# EAGLE design CPN v2 (EAGLE 9.6.2)
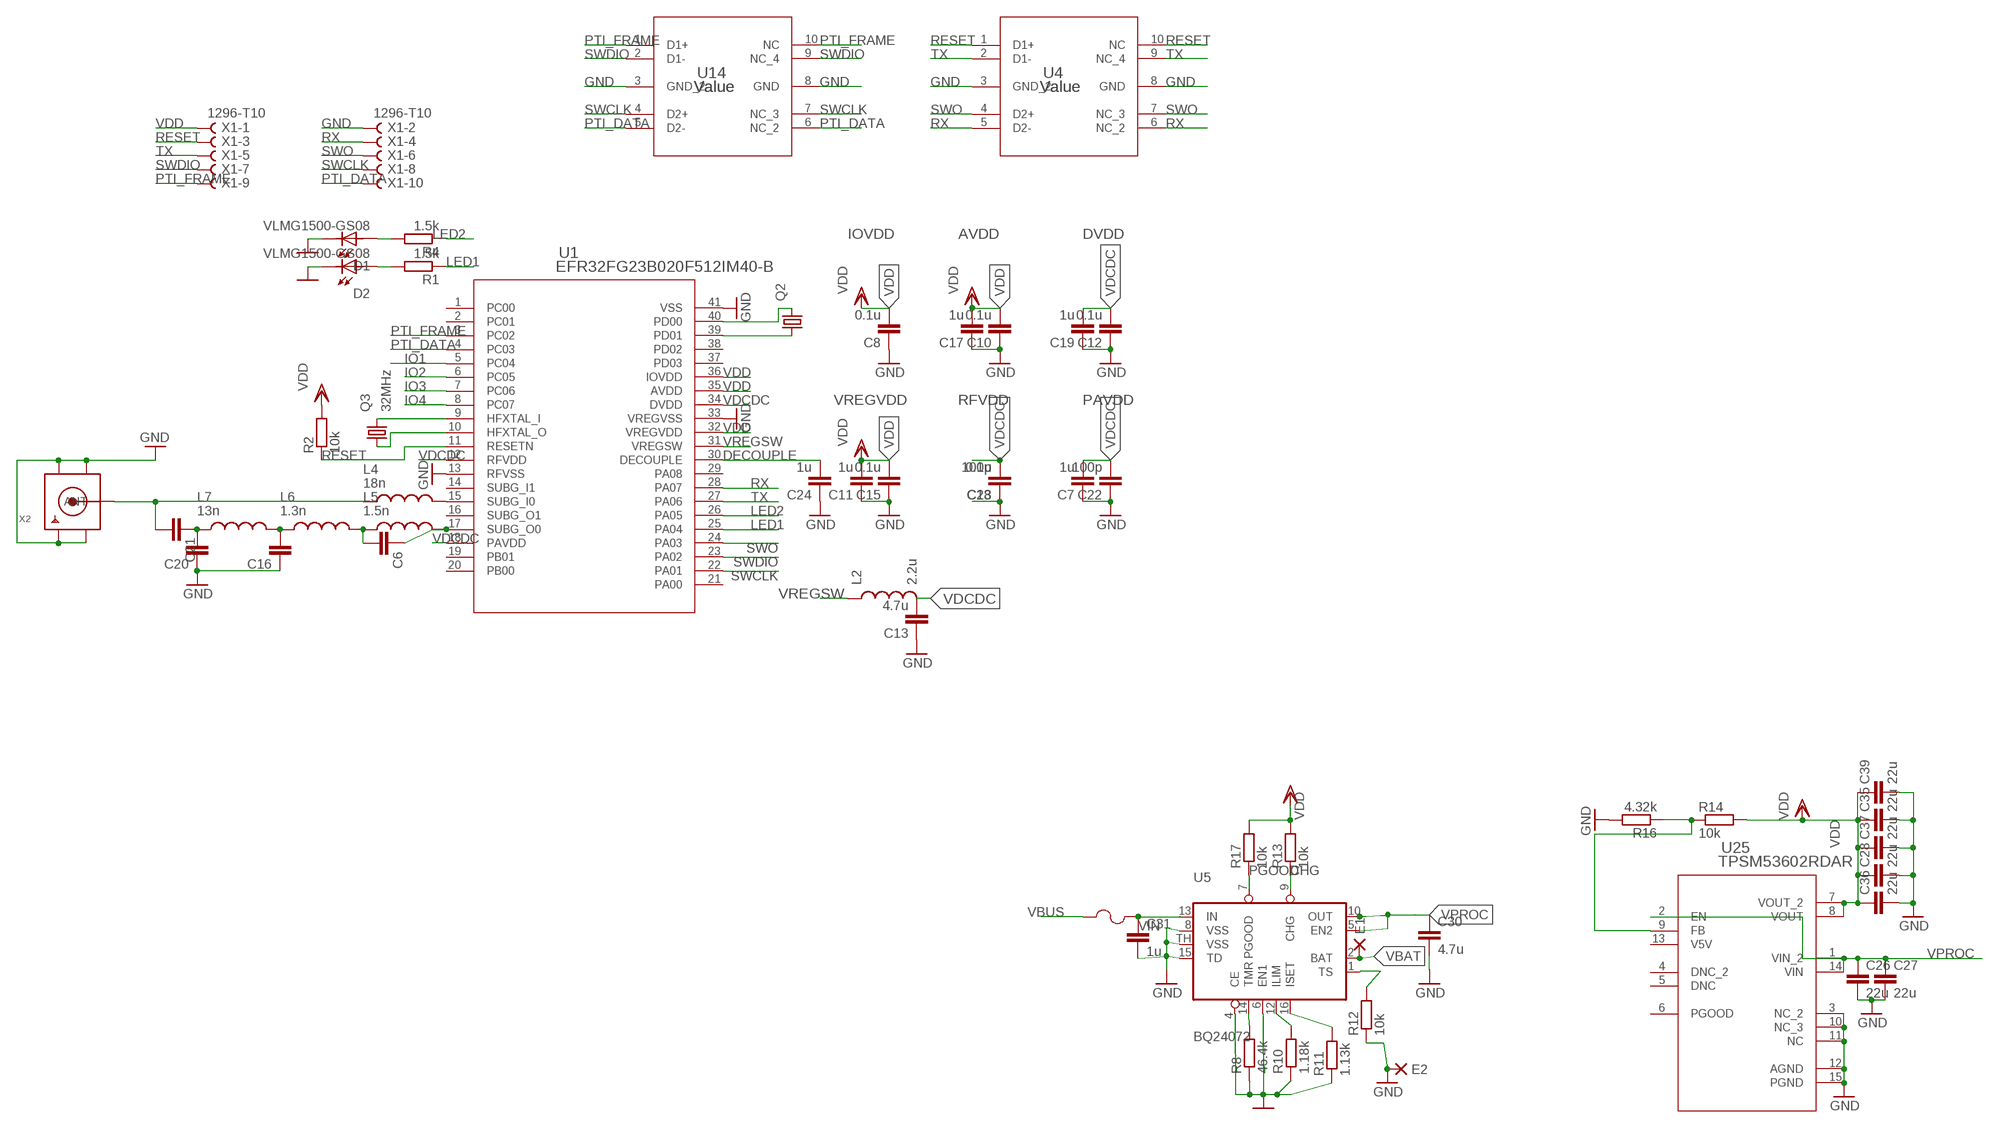
[diagram p0: schematic, sheet 1, part 1 of 2]
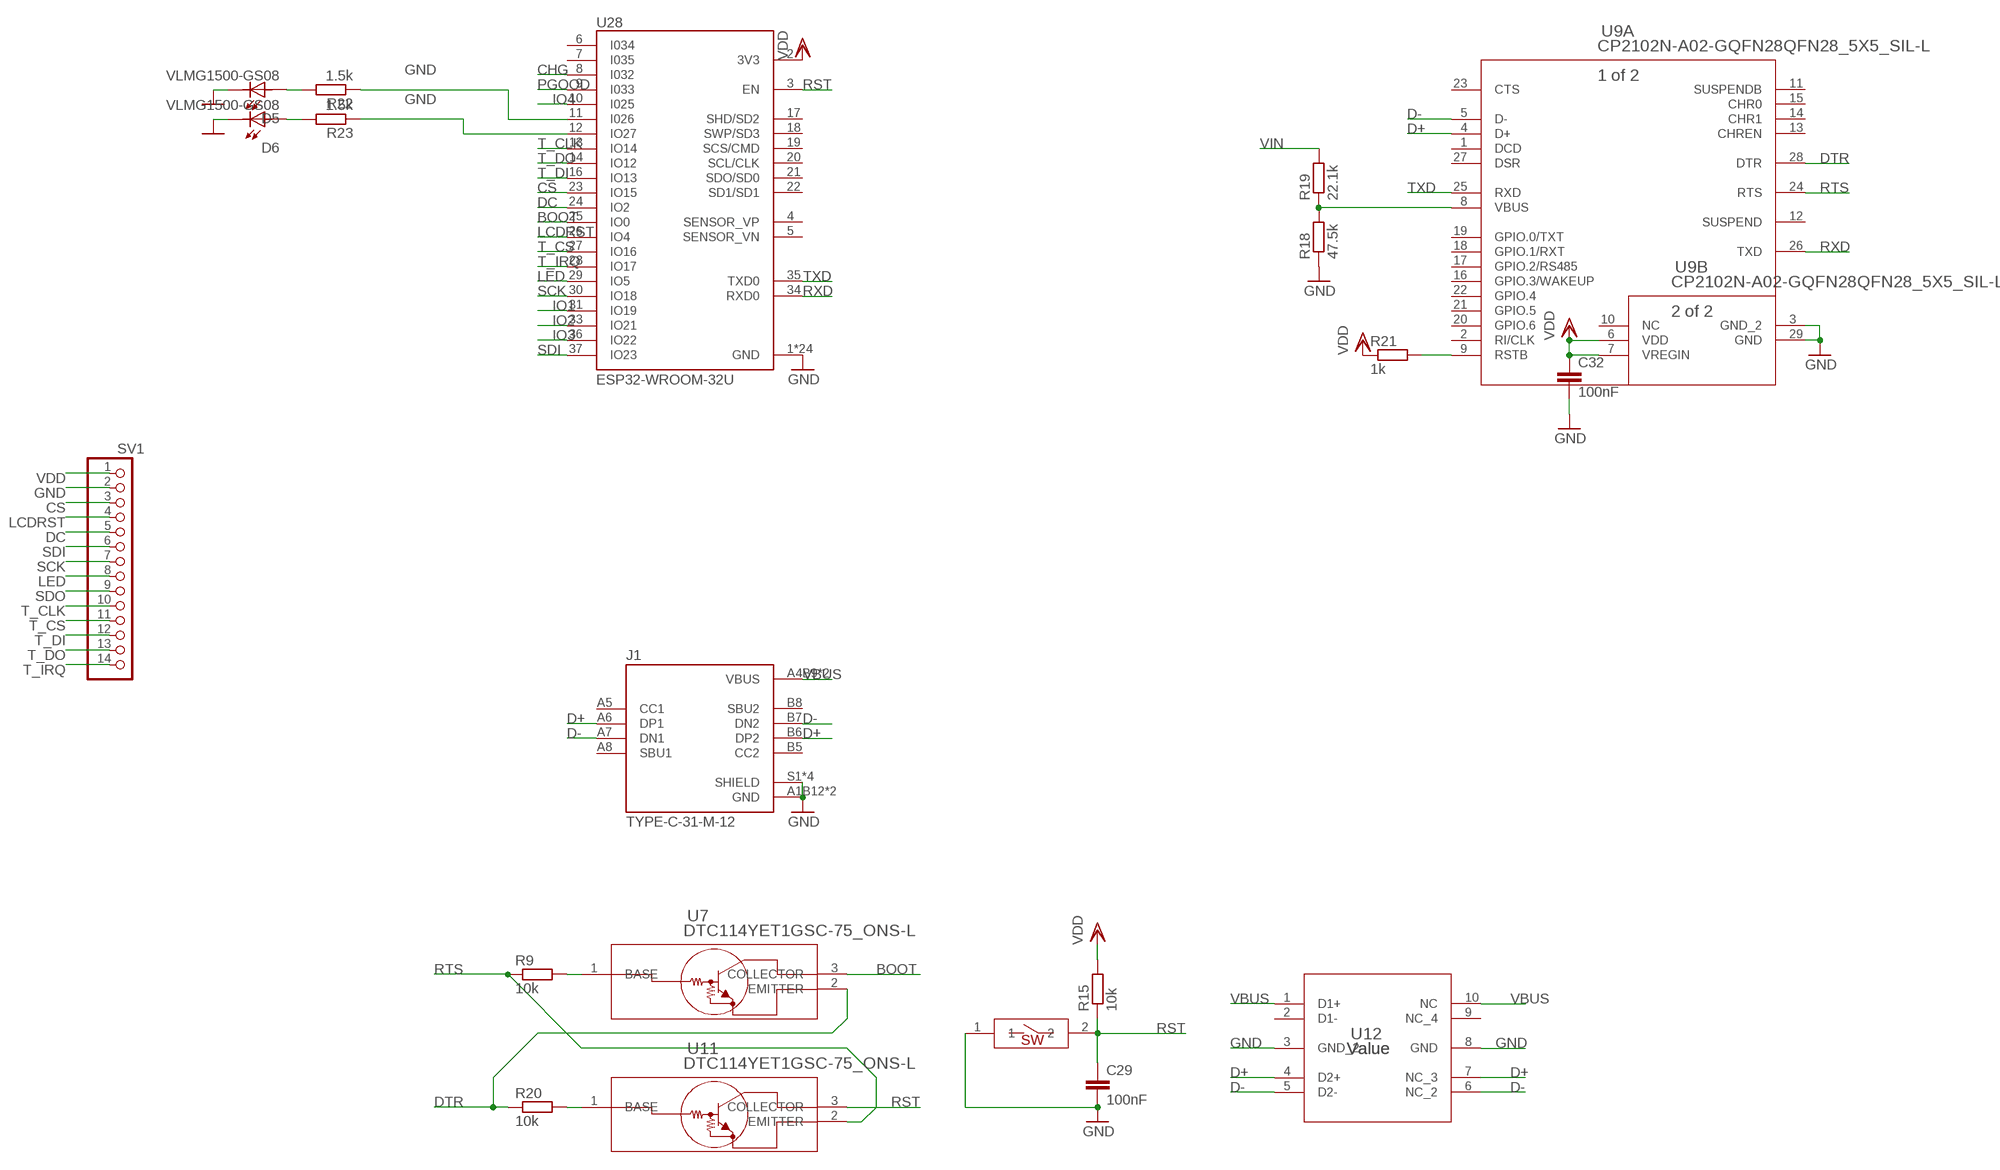
[diagram p1: schematic, sheet 1, part 2 of 2]

## Parts
C6  1.9p  CC0402  [C0402]
C7  1u  CC0402  [C0402]
C8  0.1u  CC0402  [C0402]
C10  0.1u  CC0402  [C0402]
C11  1u  CC0402  [C0402]
C12  0.1u  CC0402  [C0402]
C13  4.7u  CC0603R  [C0603R]
C15  0.1u  CC0402  [C0402]
C16  7.2p  CC0402  [C0402]
C17  1u  CC0402  [C0402]
C18  0.1u  CC0402  [C0402]
C19  1u  CC0402  [C0402]
C20  1.3p  CC0402  [C0402]
C21  220p  CC0402  [C0402]
C22  100p  CC0402  [C0402]
C23  100p  CC0402  [C0402]
C24  1u  CC0402  [C0402]
C26  22u  CC0603R  [C0603R]
C27  22u  CC0603R  [C0603R]
C28  22u  CC0603R  [C0603R]
C29  100nF  CC0402  [C0402]
C30  4.7u  CC0402  [C0402]
C31  1u  CC0402  [C0402]
C32  100nF  CC0402  [C0402]
C35  22u  CC0603R  [C0603R]
C36  22u  CC0603R  [C0603R]
C37  22u  CC0603R  [C0603R]
C39  22u  CC0603R  [C0603R]
D1  VLMG1500-GS08  [LEDC1005X35N]
D2  VLMG1500-GS08  [LEDC1005X35N]
D5  VLMG1500-GS08  [LEDC1005X35N]
D6  VLMG1500-GS08  [LEDC1005X35N]
E1  DPADS_PAD-0400-S  [DPADS_0400-S]
E2  DPADS_PAD-0400-S  [DPADS_0400-S]
F2  1210L050YR1210LSERIES_LTF-L  [1210LSERIES_LTF-L]
J1  TYPE-C-31-M-12  [HRO_TYPE-C-31-M-12]
L2  2.2u  INDUCTOR  [L0603]
L4  18n  MHQ0402P7N5JT000  [INDC0402X26N]
L5  1.5n  MHQ0402P7N5JT000  [INDC0402X26N]
L6  1.3n  MHQ0402P7N5JT000  [INDC0402X26N]
L7  13n  MHQ0402P7N5JT000  [INDC0402X26N]
Q2  KX-327-RT  [2.0X1.2]
Q3  32MHz  KX-5  [2.0X1.6_KX-5]
R1  1.5k  RR0402  [R0402]
R2  10k  RR0402  [R0402]
R4  1.5k  RR0402  [R0402]
R8  46.4k  RR0402  [R0402]
R9  10k  RR0402  [R0402]
R10  1.18k  RR0402  [R0402]
R11  1.13k  RR0402  [R0402]
R12  10k  RR0402  [R0402]
R13  10k  RR0402  [R0402]
R14  10k  RR0402  [R0402]
R15  10k  RR0402  [R0402]
R16  4.32k  RR0402  [R0402]
R17  10k  RR0402  [R0402]
R18  47.5k  RR0402  [R0402]
R19  22.1k  RR0402  [R0402]
R20  10k  RR0402  [R0402]
R21  1k  RR0402  [R0402]
R22  1.5k  RR0402  [R0402]
R23  1.5k  RR0402  [R0402]
RESET  SMDSWITCH  [RESC4217X170]
SV1  PINHD-1X14  [1X14]
U1  EFR32FG23B020F512IM40-B  [QFN_40_SIL]
U4  Value  ESD204DQAR  [DQA0010A]
U5  BQ24072  [S-PVQFN-N16]
U7  DTC114YET1GSC-75_ONS-L  [SC-75_ONS-L]
U9  CP2102N-A02-GQFN28QFN28_5X5_SIL-L  [QFN28_5X5_SIL-L]
U11  DTC114YET1GSC-75_ONS-L  [SC-75_ONS-L]
U12  Value  ESD204DQAR  [DQA0010A]
U14  Value  ESD204DQAR  [DQA0010A]
U25  TPSM53602RDAR  [B3QFN15_RDA_TEX]
U28  ESP32-WROOM-32U  [XCVR_ESP32-WROOM-32U]
X1  1296-T10  [1296-10]
X2  SMACONNECTOR  [SMA90_DIP]

## Nets
BOOT: U7.3(COLLECTOR) U28.25(IO0)
CHG: R13.1 U5.9(CHG) U28.8(I032)
CS: SV1.3 U28.23(IO15)
D+: J1.A6(DP1) J1.B6(DP2) U9.4(A:D+) U12.4(D2+) U12.7(NC_3)
D-: J1.A7(DN1) J1.B7(DN2) U9.5(A:D-) U12.5(D2-) U12.6(NC_2)
DC: SV1.5 U28.24(IO2)
DECOUPLE: C24.2 U1.30(DECOUPLE)
DTR: R20.1 U7.2(EMITTER) U9.28(A:DTR)
GND: C7.1 C8.1 C10.1 C11.1 C12.1 C13.1 C15.1 C16.1 C17.1 C18.1 C19.1 C20.1 C22.1 C23.1 C24.1 C26.2 C27.2 C28.2 C29.2 C30.2 C31.2 C32.2 C35.2 C36.2 C37.2 C39.2 D1.2 D2.2 D5.2 D6.2 E2.PAD(P) J1.A1B12(GND) J1.B1A12(GND) J1.S1(SHIELD) J1.S2(SHIELD) J1.S3(SHIELD) J1.S4(SHIELD) R8.1 R10.1 R11.1 R12.1 R16.2 R18.1 RESET.1 SV1.2 U1.13(RFVSS) U1.33(VREGVSS) U1.41(VSS) U4.3(GND_2) U4.8(GND) U5.4(CE) U5.6(EN1) U5.8(VSS) U5.15(TD) U5.TH(VSS) U9.3(B:GND_2) U9.29(B:GND) U12.3(GND_2) U12.8(GND) U14.3(GND_2) U14.8(GND) U25.3(NC_2) U25.10(NC_3) U25.11(NC) U25.12(AGND) U25.15(PGND) U28.1(GND) U28.15(GND) U28.38(GND) U28.G.1(GND) U28.G.2(GND) U28.G.4(GND) U28.G.5(GND) U28.G.6(GND) U28.G.7(GND) U28.G.8(GND) U28.G.9(GND) U28.G.10(GND) U28.G.11(GND) U28.G.12(GND) U28.G.13(GND) U28.G.14(GND) U28.G.15(GND) U28.G.16(GND) U28.G.17(GND) U28.G.18(GND) U28.G.19(GND) U28.G.20(GND) U28.G.21(GND) U28.G.22(GND) X1.2 X2.GND1 X2.GND2 X2.GND3 X2.GND4
IO1: U1.5(PC04) U28.31(IO19)
IO2: U1.6(PC05) U28.33(IO21)
IO3: U1.7(PC06) U28.36(IO22)
IO4: U1.8(PC07) U28.10(I025)
LCDRST: SV1.4 U28.26(IO4)
LED: SV1.8 U28.29(IO5)
LED1: R1.1 U1.25(PA04)
LED2: R4.1 U1.26(PA05)
N$1: D2.1 R1.2
N$5: C21.2 L4.1 X2.ANTENNA(ANT)
N$6: C6.1 L5.2 U1.17(SUBG_O0)
N$7: D1.1 R4.2
N$11: R8.2 U5.14(TMR)
N$12: R10.2 U5.12(ILIM)
N$13: R11.2 U5.16(ISET)
N$14: R18.2 R19.1 U9.8(A:VBUS)
N$15: R21.2 U9.9(A:RSTB)
N$16: Q3.3 U1.9(HFXTAL_I)
N$17: Q3.1 U1.10(HFXTAL_O)
N$18: Q2.1 U1.39(PD01)
N$19: Q2.2 U1.40(PD00)
N$20: L4.2 U1.15(SUBG_I0)
N$21: D5.1 R22.2
N$22: C6.2 L5.1 L6.2
N$23: C16.2 L6.1 L7.2
N$24: C20.2 C21.1 L7.1
N$25: D6.1 R23.2
N$26: R23.1 U28.12(IO27)
N$27: R22.1 U28.11(I026)
N$29: R20.2 U11.1(BASE)
N$30: R9.2 U7.1(BASE)
N$91: R14.1 R16.1 U25.9(FB)
PGOOD: R17.1 U5.7(PGOOD) U28.9(I033)
PTI_DATA: U1.4(PC03) U14.5(D2-) U14.6(NC_2) X1.10
PTI_FRAME: U1.3(PC02) U14.1(D1+) U14.10(NC) X1.9
RESET: R2.1 U1.11(RESETN) U4.1(D1+) U4.10(NC) X1.3
RST: C29.1 R15.1 RESET.2 U11.3(COLLECTOR) U28.3(EN)
RTS: R9.1 U9.24(A:RTS) U11.2(EMITTER)
RX: U1.28(PA07) U4.5(D2-) U4.6(NC_2) X1.4
RXD: U9.26(A:TXD) U28.34(RXD0)
SCK: SV1.7 U28.30(IO18)
SDI: SV1.6 U28.37(IO23)
SDO: SV1.9
SWCLK: U1.22(PA01) U14.4(D2+) U14.7(NC_3) X1.8
SWDIO: U1.23(PA02) U14.2(D1-) U14.9(NC_4) X1.7
SWO: U1.24(PA03) U4.4(D2+) U4.7(NC_3) X1.6
T_CLK: SV1.10 U28.13(IO14)
T_CS: SV1.11 U28.27(IO16)
T_DI: SV1.12 U28.16(IO13)
T_DO: SV1.13 U28.14(IO12)
T_IRQ: SV1.14 U28.28(IO17)
TS: R12.2 U5.1(TS)
TX: U1.27(PA06) U4.2(D1-) U4.9(NC_4) X1.5
TXD: U9.25(A:RXD) U28.35(TXD0)
VBAT: E1.PAD(P) U5.2(BAT)
VBUS: F2.1 J1.A4B9(VBUS) J1.B4A9(VBUS) U12.1(D1+) U12.10(NC)
VDCDC: C7.2 C12.2 C13.2 C18.2 C19.2 C22.2 C23.2 L2.2 U1.12(RFVDD) U1.18(PAVDD) U1.34(DVDD)
VDD: C8.2 C10.2 C11.2 C15.2 C17.2 C28.1 C32.1 C35.1 C36.1 C37.1 C39.1 R2.2 R13.2 R14.2 R15.2 R17.2 R21.1 SV1.1 U1.32(VREGVDD) U1.35(AVDD) U1.36(IOVDD) U9.6(B:VDD) U9.7(B:VREGIN) U25.7(VOUT_2) U25.8(VOUT) U28.2(3V3) X1.1
VIN: C31.1 F2.2 R19.2 U5.13(IN)
VPROC [NCLS3V7]: C26.1 C27.1 C30.1 U5.5(EN2) U5.10(OUT) U25.1(VIN_2) U25.2(EN) U25.14(VIN)
VREGSW: L2.1 U1.31(VREGSW)
Unconnected: J1.A5(CC1) J1.A8(SBU1) J1.B5(CC2) J1.B8(SBU2) U1.1(PC00) U1.2(PC01) U1.14(SUBG_I1) U1.16(SUBG_O1) U1.19(PB01) U1.20(PB00) U1.21(PA00) U1.29(PA08) U1.37(PD03) U1.38(PD02) U9.1(A:DCD) U9.2(A:RI/CLK) U9.10(B:NC) U9.11(A:SUSPENDB) U9.12(A:SUSPEND) U9.13(A:CHREN) U9.14(A:CHR1) U9.15(A:CHR0) U9.16(A:GPIO.3/WAKEUP) U9.17(A:GPIO.2/RS485) U9.18(A:GPIO.1/RXT) U9.19(A:GPIO.0/TXT) U9.20(A:GPIO.6) U9.21(A:GPIO.5) U9.22(A:GPIO.4) U9.23(A:CTS) U9.27(A:DSR) U12.2(D1-) U12.9(NC_4) U25.4(DNC_2) U25.5(DNC) U25.6(PGOOD) U25.13(V5V) U28.4(SENSOR_VP) U28.5(SENSOR_VN) U28.6(I034) U28.7(I035) U28.17(SHD/SD2) U28.18(SWP/SD3) U28.19(SCS/CMD) U28.20(SCL/CLK) U28.21(SDO/SD0) U28.22(SD1/SD1)

## Notes on the sheet
- IOVDD | AVDD | DVDD
- VREGVDD | RFVDD | PAVDD

## Library data of the parts
C6-C8 C10-C12 C15-C24 C29-C32 = eagle-ltspice:C: CAPACITOR, European symbol; SPICEMODEL: NONE; SPICEPREFIX: C
C13 C26-C28 C35-C37 C39 = eagle-ltspice:C: CAPACITOR, European symbol
D1 D2 D5 D6 = VLMG1500-GS08:VLMG1500-GS08: 0402 GREEN 571nm 35MCD 65° Rectangle with Flat Top SMT LED; AVAILABILITY: Unavailable; DESCRIPTION: 0402 GREEN 571nm 35MCD 65° Rectangle with Flat Top SMT LED; MF: Vishay; MP: VLMG1500-GS08; PACKAGE: 0402 Vishay; PRICE: None
E1 E2 = 52101-101-REV-A_v16:DPADS_PAD: WIRE PAD Standard US Drill Sizes and SMD pads; BOM: EXCLUDE
F2 = 1210 FUSE:1210L050YR; BUILT_BY: EMA_UL_Team; MANUFACTURER_PART_NUMBER: 1210L050YR; SOURCELIBRARY: LittleFuse_2015-04-13; VENDOR: Littelfuse Inc
J1 = TYPE-C-31-M-12:TYPE-C-31-M-12: USB Connectors 24 Receptacle 1 8.94*7.3mm RoHS Check prices <https://pricing.snapeda.com/parts/TYPE-C-31-M-12/HRO%20Electronics%20Co.%2C%20Ltd./view-part?ref=eda>; AVAILABILITY: Not in stock; DESCRIPTION: USB Connectors 24 Receptacle 1 8.94*7.3mm RoHS; MF: HRO Electronics Co., Ltd.; MP: TYPE-C-31-M-12; PACKAGE: Package; PRICE: None
L2 = BeagleBone_Blue_R3:INDUCTOR: Inductors Basic Inductor/Choke - 0603 and 1206. Footprints are not proven and vary greatly between part numbers. SRN6045- 33uH, 20% 1.4A
L4-L7 = MHQ0402P7N5JT000:MHQ0402P7N5JT000: 221 NH 5% GOLD TERMINAL; AVAILABILITY: Unavailable; DESCRIPTION: FIXED IND 7.5NH 200MA 1.2 OHM; MF: TDK; MP: MHQ0402P7N5JT000; PACKAGE: 0402 TDK; PRICE: None
Q2 = crystal-geyer_V1_0:KX-327: Tuning Fork Crystals (kHz) SMD: KX327 - Serie Model Size l/w/h [mm] Frequency Range Frequency Stability Temp. Range [°C] Load Capacitance AECQ 200 availabel Datasheet KX-327VT KX-327FT KX-327RT KX-327NHT KX-327NHF KX-327L KX-327S 1.25/1.05/0.5 1.6/1.0/0.5 2.0/1.2/0.6 3.2/1.5/0.8 3.2/1.5/0.8 7.0/1.5/1.4 8.2/3.8/2.5 32,768 kHz 32,768 kHz 32,768 kHz 32,768 kHz 32,768 kHz 32,768 kHz 32,768 kHz ±10 … ±20ppm ±10 … ±20ppm ±10 … ±20ppm ±10 … ±20ppm ±10 … ±20ppm ±10 … ±20ppm ±5 … ±20ppm (*) -40°C …+85°C (*) -40°C …+85°C (*) -40°C …+85°C (*) -40°C …+85°C (*) -40°C …+125°C (*) -40°C …+85°C (*) -40°C …+85°C 7/9/12,5 7/9/12,5 7/9/12,6 7/9/12,5 9/12,5 7/9/12,5 6/12,5 - - - - yes - - KX-327VT.pdf <http://www.geyer-electronic.de/uploads/tx_userartikelfrequenz/GEYER-KX-327VT.pdf> KX-327FT.pdf <http://www.geyer-electronic.de/uploads/tx_userartikelfrequenz/GEYER-KX-327FT.pdf> KX-327RT.pdf <http://www.geyer-electronic.de/uploads/tx_userartikelfrequenz/GEYER-KX-327RT.pdf> KX-327NHT.pdf <http://www.geyer-electronic.de/uploads/tx_userartikelfrequenz/GEYER-KX-327NHT.pdf> KX-327NHF.pdf <http://www.geyer-electronic.de/uploads/tx_userartikelfrequenz/GEYER-KX-327NHF.pdf> KX-327L.pdf <http://www.geyer-electronic.de/uploads/tx_userartikelfrequenz/GEYER-KX-327L.pdf> KX-327S.pdf <http://www.geyer-electronic.de/uploads/tx_userartikelfrequenz/GEYER-KX-327S.pdf> <http://www.geyer-electronic.de/fileadmin/template/img/logo-geyer-electronic.png> Details see: http://www.geyer-electronic.de/Frequenz-Produkte.9.0.html Created 2016-06-07, Hans Locher 2016 (C) Geyer Quartz Technology KX327VT,KX327FT,KX327RT,KX327NHT,KX327NHF,KX327S,KX327L;125105;1610;2012;3215;7015;8238;1,25x1,05,1.25x1.05;1,6x1,0,1.6x1.0;2,0x1,2,2.0x1.2;3,2x1,5,3.2x1.5;8,2x3,8,8.2x3.8,7.0x1.5,7,0x1,532.768kHz
Q3 = crystal-geyer_V1_0:KX: Quartz Crystals (MHz) SMD: KX - Serie Model Size l/w/h [mm] Frequency Range Frequency Stability Temp. Range [°C] Load Capacitance AECQ 200 availabel Datasheet KX-4 KX-5 KX-6 KX-7 KX-9A KX-9B KX-12A KX-12B KX-13 KX-20 KX-K KX-KS 1.6/1.2/0.3 2.0/1.6/0.45 2.5/2.0/0.55 3.2/2.5/0.8 5.0/3.2/1.0 5.0/3.2/1.1 6.0/3.5/1.1 6.0/3.5/1.0 7.0/5.0 /1.3 11.6/5.5/1.6 12.3/4.5/4.2 12.3/4.5/3.2 24.0 ~ 80.0 MHz 16.0 ~ 80.0 MHz 12.0 ~ 80.0 MHz 8.0 ~ 60.0 MHz 7,68 ~ 300,0 MHz 8,0 ~ 50,0 MHz 8,0 ~ 150,0 MHz 8,0 ~ 50,0 MHz 6,0 ~ 160,0 MHz 3,579 ~ 25,0 MHz 3,579 ~ 70,0 MHz 3,579 ~ 70,0 MHz ±10 … ±50ppm ±10 … ±50ppm ±10 … ±50ppm ±10 … ±50ppm ±10 … ±50ppm ±10 … ±50ppm ±10 … ±50ppm ±10 … ±50ppm ±10 … ±50ppm ±50ppm ±10 … ±50ppm ±10 … ±50ppm (*) -40°C …+85°C (*) -40°C …+125°C (*) -40°C …+125°C (*) -40°C …+125°C (*) -40°C …+105°C (*) -40°C …+105°C (*) -40°C …+125°C (*) -40°C …+105°C (*) -40°C …+105°C (*) -40°C …+105°C (*) -40°C …+85°C (*) -40°C …+85°C 8, 8…16 8, 8…16 10, 8…16 12, 7…20 16, 10…20 16, 10…20 16, 10…20 16, 12…20 16, 12…20 16, 12…20 16, 12…30 16, 12…30 - yes yes yes - - - - - - - - KX-4.pdf <http://www.geyer-electronic.de/uploads/tx_userartikelfrequenz/GEYER-KX-4.pdf> KX-5.pdf <http://www.geyer-electronic.de/uploads/tx_userartikelfrequenz/GEYER-KX-5.pdf> KX-6.pdf <http://www.geyer-electronic.de/uploads/tx_userartikelfrequenz/GEYER-KX-6.pdf> KX-7.pdf <http://www.geyer-electronic.de/uploads/tx_userartikelfrequenz/GEYER-KX-7.pdf> KX-9A.pdf <http://www.geyer-electronic.de/uploads/tx_userartikelfrequenz/GEYER-KX-9A.pdf> KX-9B.pdf <http://www.geyer-electronic.de/uploads/tx_userartikelfrequenz/GEYER-KX-9B.pdf> KX-12A.pdf <http://www.geyer-electronic.de/uploads/tx_userartikelfrequenz/GEYER-KX-12A.pdf> KX-12B.pdf <http://www.geyer-electronic.de/uploads/tx_userartikelfrequenz/GEYER-KX-12B.pdf> KX-13.pdf <http://www.geyer-electronic.de/uploads/tx_userartikelfrequenz/GEYER-KX-13.pdf> KX-20.pdf <http://www.geyer-electronic.de/uploads/tx_userartikelfrequenz/GEYER-KX-20.pdf> KX-K.pdf <http://www.geyer-electronic.de/uploads/tx_userartikelfrequenz/GEYER-KX-K.pdf> KX-KS.pdf <http://www.geyer-electronic.de/uploads/tx_userartikelfrequenz/GEYER-KX-KS.pdf> <http://www.geyer-electronic.de/fileadmin/template/img/logo-geyer-electronic.png> Details see: http://www.geyer-electronic.de/Frequenz-Produkte.9.0.html Created 2016-06-07, Hans Locher 2016 (C) Geyer Quartz Technology KX4,KX5,KX6,KX7,KX9A,KX9B,KX12A,KX12B,KX13,KX20,KXK,KXKS;1612;2016;2520;3225;5032;6035;7050;11655;12345;1,6x1,2;2,0x1,6;2,5x2,0;3,2x2,5;5,0x3,2;6,0x3,5;7,0x5,0;11,6x5,5;12,3x4,5;12,3x4,5;1.6x1.2;2.0x1.6;2.5x2.0;3.2x2.5;5.0x3.2;6.0x3.5;7.0x5.0;11.6x5.5;12.3x4.5;12.3x4.5;
R1 R2 R4 R8-R23 = eagle-ltspice:R: RESISTOR, European symbol; SPICEMODEL: NONE; SPICEPREFIX: R
RESET = SMD SWITCH:SMDSWITCH
SV1 = adafruit:PINHD-1X14: PIN HEADER
U1 = EFR32FG23B020F512IM40-B:EFR32FG23B020F512IM40-B; COPYRIGHT: Copyright (C) 2022 Ultra Librarian. All rights reserved.; MANUFACTURER_PART_NUMBER: EFR32FG23B020F512IM40-B; MFR_NAME: Silicon Labs
U4 U12 U14 = ESD204DQAR:ESD204DQAR; MANUFACTURER: Texas Instruments; PARTNUMBER: ESD204DQAR; REFDES: RefDes; TYPE: TYPE
U5 = Simplex-ICs:BQ24072: TI BQ24072 - Li battery charger and power path management ic
U7 U11 = DTC114YET1G:DTC114YET1G; BUILT_BY: EMA_Justin; COPYRIGHT: Copyright (C) 2018 Accelerated Designs. All rights reserved; DATASHEET: https://www.onsemi.com/pub/Collateral/DTC114Y-D.PDF; MANUFACTURER_PART_NUMBER: DTC114YET1G; SOURCELIBRARY: ON_Semiconductor_2020-01-13; VENDOR: ON Semiconductor
U9 = CP2102N:CP2102N-A02-GQFN28; BUILT_BY: EMA_Cory; COPYRIGHT: Copyright (C) 2018 Accelerated Designs. All rights reserved; DATASHEET: https://www.silabs.com/documents/public/data-sheets/cp2102n-datasheet.pdf; MANUFACTURER_PART_NUMBER: CP2102N-A02-GQFN28; SOURCELIBRARY: Silicon_Labs_2020-02-14; VENDOR: Silicon Labs
U25 = TPSM53602:TPSM53602RDAR; BUILT_BY: EMA_Cory; COPYRIGHT: Copyright (C) 2018 Accelerated Designs. All rights reserved; DATASHEET: https://www.ti.com/lit/ds/symlink/tpsm53602.pdf?ts=1593032137197&ref_url=https%253A%252F%252Fwww.ti.com%252Fstore%252Fti%252Fen%252Fp%252Fproduct%252F%253Fp%253DTPSM53602RDAR; MANUFACTURER_PART_NUMBER: TPSM53602RDAR; SOURCELIBRARY: TI_2020-06-27; VENDOR: Texas Instruments
U28 = ESP32-WROOM-32U:ESP32-WROOM-32U: Wi-Fi/BT BLE Module ESP32-D0WD SPI Flash UART U.FL Conn. Check prices <https://pricing.snapeda.com/parts/ESP32-WROOM-32U/Espressif%20Systems/view-part?ref=eda>; AVAILABILITY: In Stock; DESCRIPTION: Bluetooth, WiFi 802.11b/g/n, Bluetooth v4.2 +EDR, Class 1, 2 and 3 Transceiver Module 2.4GHz ~ 2.5GHz Antenna Not Included, U.FL Surface Mount; MF: Espressif Systems; MP: ESP32-WROOM-32U; PACKAGE: Module Espressif Systems; PRICE: None; PURCHASE-URL: https://pricing.snapeda.com/search/part/ESP32-WROOM-32U/?ref=eda
X1 = con-leotronics:1296-T10: 1.27mm SINGLE ROW FEMALE SOCKET Source: http://www.leotronics.co.uk/Conexcon/Data%20Sheets/sec.%20A/1296ing.pdf; OC_FARNELL: unknown; OC_NEWARK: unknown
X2 = adafruit:SMACONNECTOR: SMA Connector 90° DIP SMA Connector, 50 Ohm (4UConnector: 07259)

## Net classes
2 NCLS3V7: width 0.178 mm, drill 0.178 mm, clearance 0.178 mm

## Board
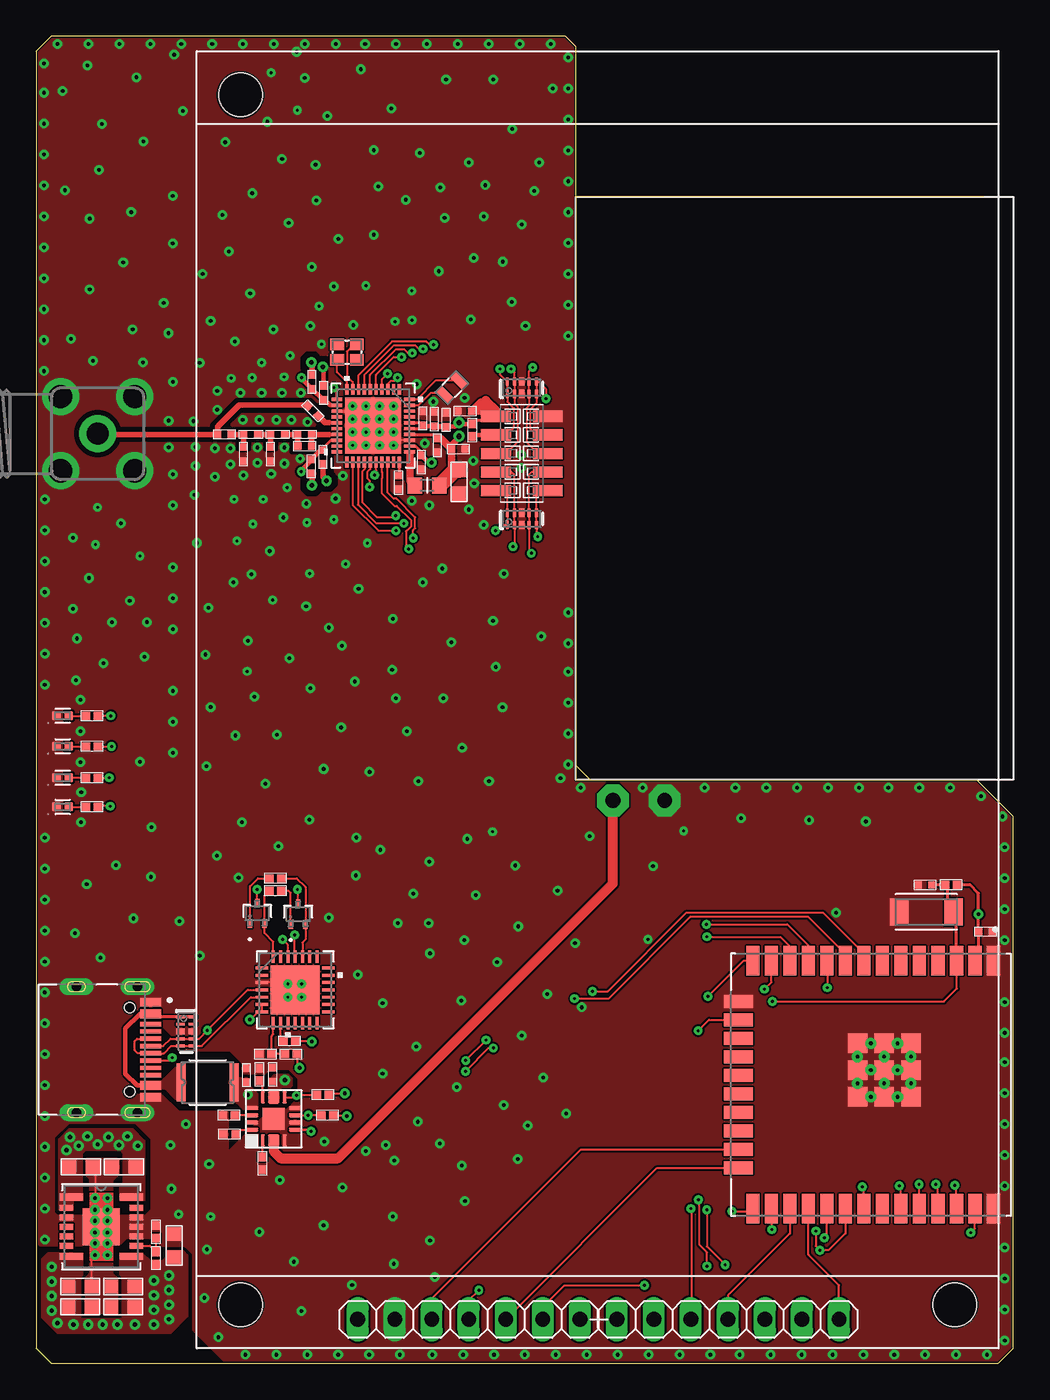
[diagram p2: board, top side]
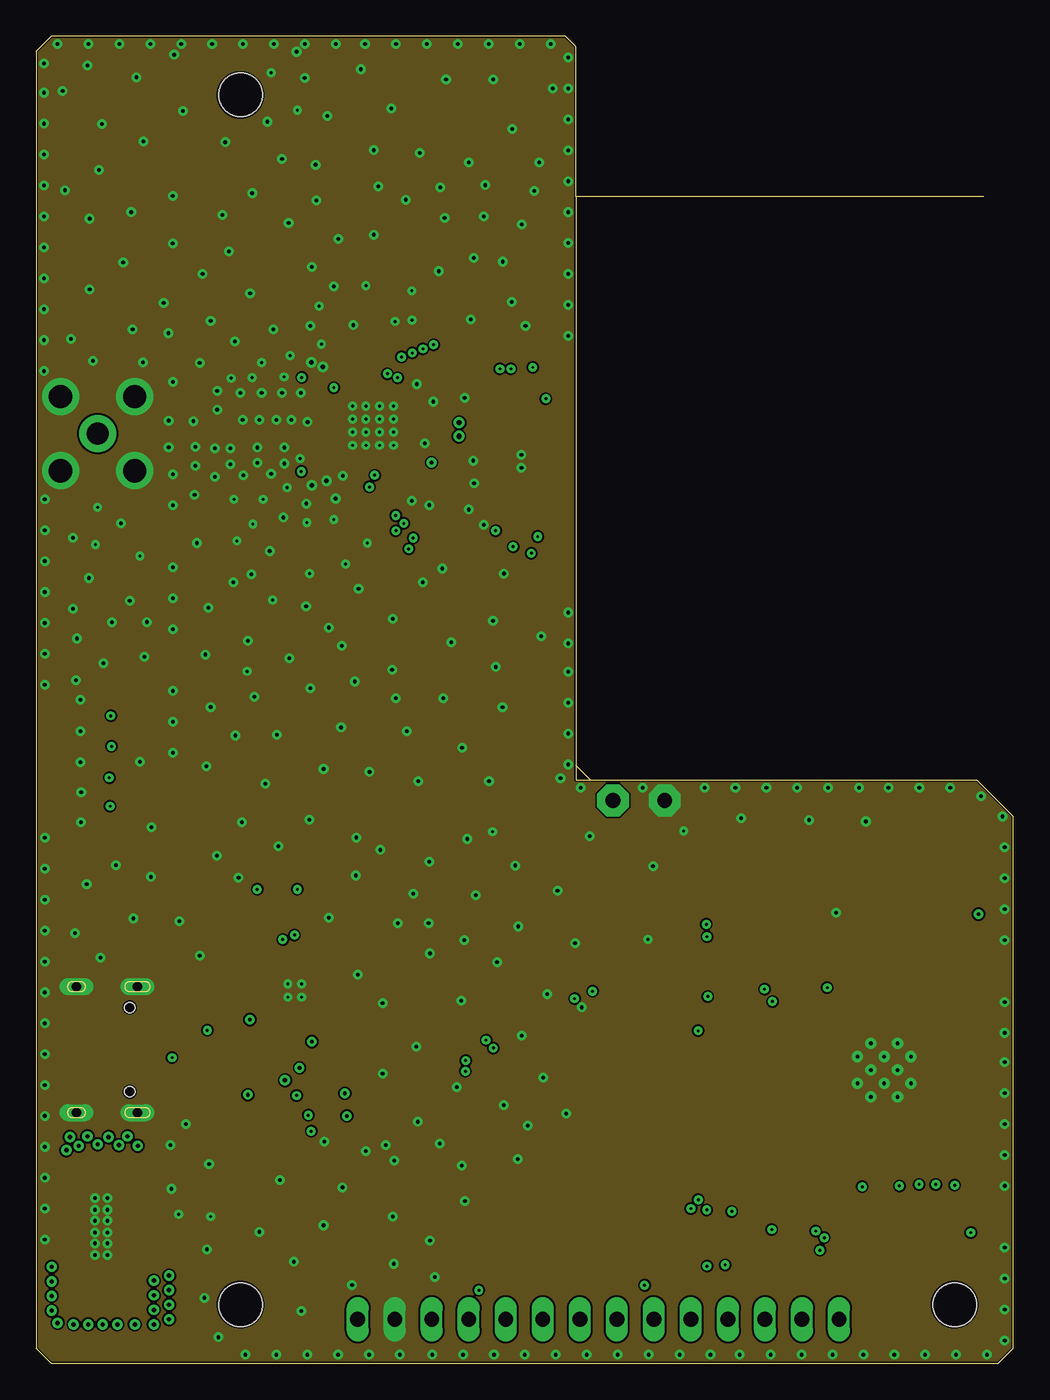
[diagram p3: board, inner layer Route2]
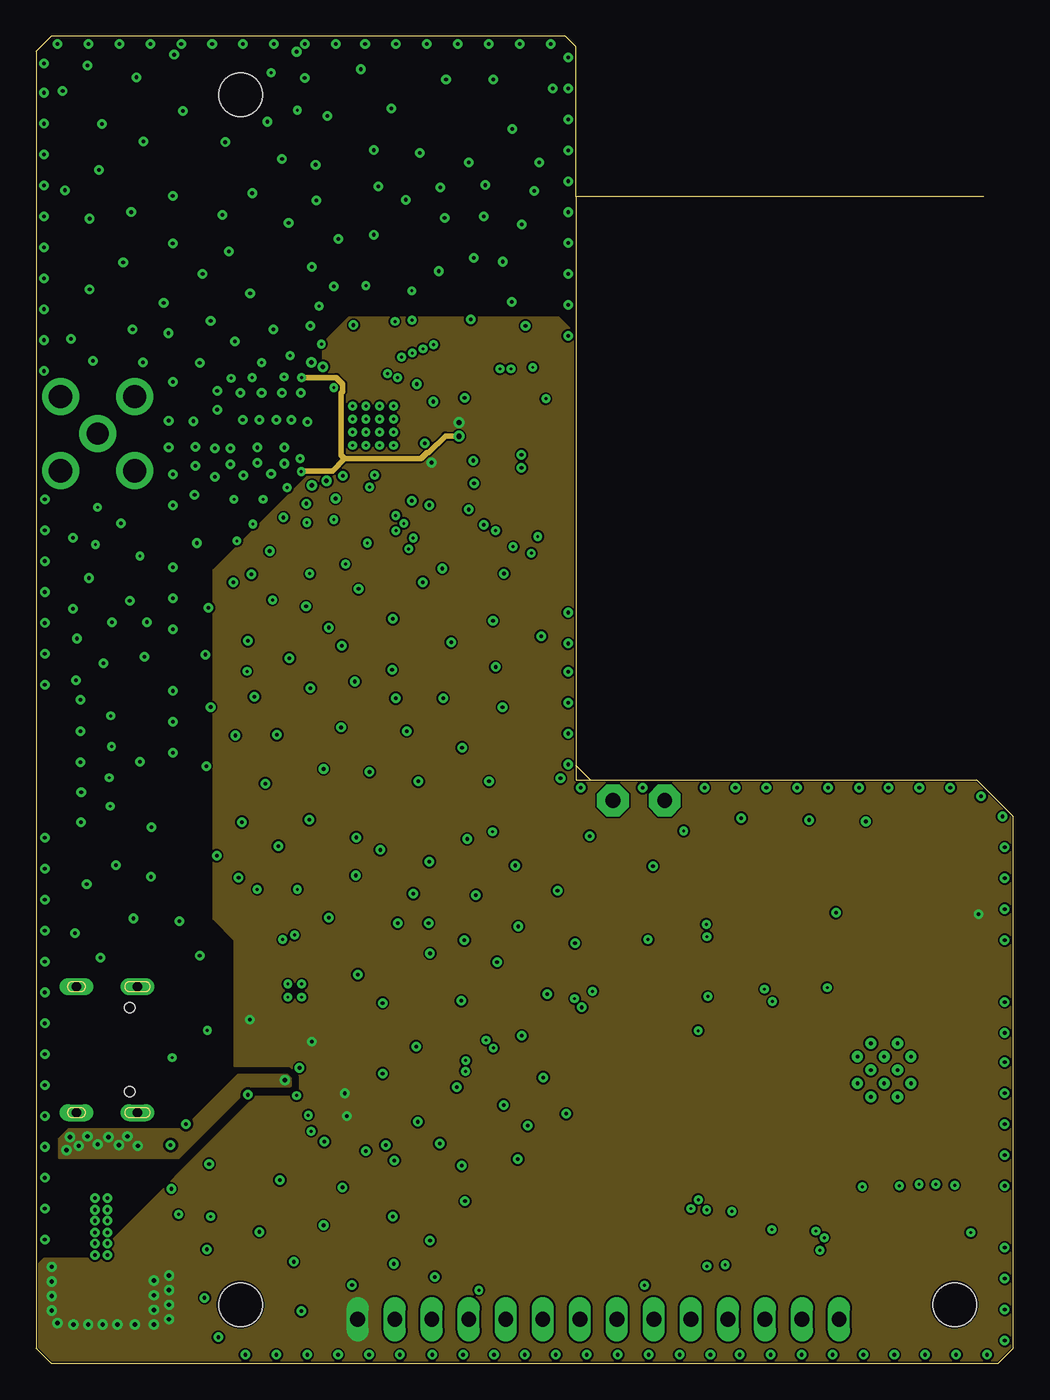
[diagram p4: board, inner layer Route15]
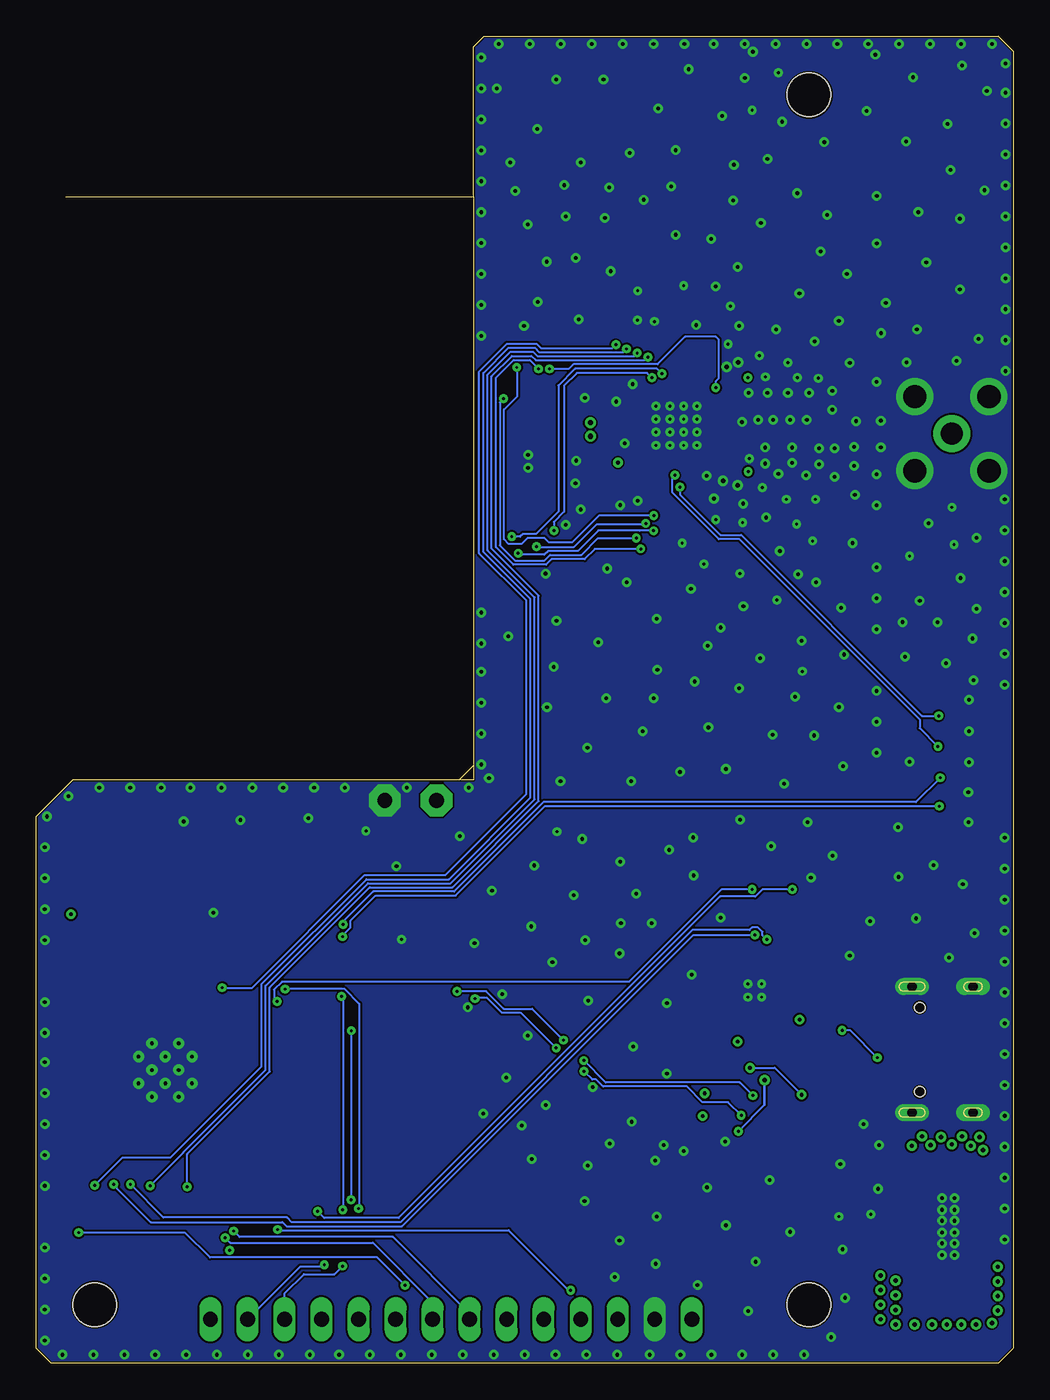
[diagram p5: board, bottom side, seen from below]

Size 67 x 91 mm. Coordinates in mm from the lower left corner, seen from the top.
Outline: 65,80 37,80
Outline: 37,80 37,41
Outline: 37,41 37,40 38,40
Outline: 38,40 64.5,40 67,37.5 67,1 66,0 1,0 0,1 0,90 1,91 36.3,91 37,90.3 37,80
Outline: 38,40 37,41
Copper layers (1+2*15+16): Top 0.035mm / dielectric 0.51mm / Route2 0.035mm / dielectric 0.15mm / Route15 0.035mm / dielectric 0.2mm / Bottom 0.035mm
Design rules "default *": minimum track width 5mil, minimum drill 0.2mm, track to track 5mil, track to pad 5mil, pad to pad 5mil, via to via 5mil, smd to smd 5mil, copper to edge 5mil, drill to drill 6mil, minimum pad ring 10mil, minimum via ring 8mil, stop-mask expansion 0mil, vias tented up to drill 40mil, thermal gap 0mil
Holes 3 mm at 63,4 14,4 14,87
tRestrict: area 18.3,59.6 to 20.5,62.1; area 18.3,66.4 to 19.9,69.2; area 2.7,62.3 to 5.7,65.2; 32 lines

### Footprints (pad centres in the part's own frame; a part is rotated, then mirrored left to right if it is on the bottom)
C0402 = smd 0.5 x 0.5: 1 -0.475,0; 2 0.475,0
C0603R = smd 0.95 x 0.95: 1 -0.85,0; 2 0.75,0
LEDC1005X35N = smd 0.59 x 0.61: 1 -0.415,0; 2 0.415,0
DPADS_0400-S = drill 1.016 pad 2.184 octagon: PAD 0,0
1210LSERIES_LTF-L = smd 0.635 x 2.591: 1 -1.816,0; 2 1.816,0
HRO_TYPE-C-31-M-12 = smd 0.6 x 1.45: A1B12 -3.25,5.095; A4B9 -2.45,5.095; B1A12 3.25,5.095; B4A9 2.45,5.095 | smd 0.3 x 1.45: A5 -1.25,5.095; A6 -0.25,5.095; A7 0.25,5.095; A8 1.25,5.095; B5 1.75,5.095; B6 0.75,5.095; B7 -0.75,5.095; B8 -1.75,5.095 | drill 0.65 pad 1.05 long: S1 -4.32,4.18; S2 4.32,4.18; S3 -4.32,0; S4 4.32,0 | hole 0.7: -2.89,3.65; 2.89,3.65
L0603 = smd 1 x 1.1: 1 -0.85,0; 2 0.85,0
INDC0402X26N = smd 0.5 x 0.5: 1 -0.732,0; 2 0.232,0
2.0X1.2 = smd 0.6 x 1.1: 1 -0.7,0; 2 0.7,0
2.0X1.6_KX-5 = smd 0.95 x 0.8: 1 -0.675,-0.525; 2 0.675,-0.525; 3 0.675,0.525; 4 -0.675,0.525
R0402 = smd 0.6 x 0.55: 1 -0.425,0; 2 0.425,0
RESC4217X170 = smd 1.254 x 1.829: 1 -1.875,0; 2 1.875,0
1X14 = drill 1.016 long: 1 -16.51,0; 2 -13.97,0; 3 -11.43,0; 4 -8.89,0; 5 -6.35,0; 6 -3.81,0; 7 -1.27,0; 8 1.27,0; 9 3.81,0; 10 6.35,0; 11 8.89,0; 12 11.43,0; 13 13.97,0; 14 16.51,0
QFN_40_SIL = smd 0.74 x 0.22: 1 -2.495,1.8; 2 -2.495,1.4; 3 -2.495,1; 4 -2.495,0.6; 5 -2.495,0.2; 6 -2.495,-0.2; 7 -2.495,-0.6; 8 -2.495,-1; 9 -2.495,-1.4; 10 -2.495,-1.8; 21 2.495,-1.8; 22 2.495,-1.4; 23 2.495,-1; 24 2.495,-0.6; 25 2.495,-0.2; 26 2.495,0.2; 27 2.495,0.6; 28 2.495,1; 29 2.495,1.4; 30 2.495,1.8 | smd 0.22 x 0.74: 11 -1.8,-2.495; 12 -1.4,-2.495; 13 -1,-2.495; 14 -0.6,-2.495; 15 -0.2,-2.495; 16 0.2,-2.495; 17 0.6,-2.495; 18 1,-2.495; 19 1.4,-2.495; 20 1.8,-2.495; 31 1.8,2.495; 32 1.4,2.495; 33 1,2.495; 34 0.6,2.495; 35 0.2,2.495; 36 -0.2,2.495; 37 -0.6,2.495; 38 -1,2.495; 39 -1.4,2.495; 40 -1.8,2.495 | smd 3.85 x 3.85: 41 0,0
DQA0010A = smd 0.565 x 0.2: 1 -0.417,1; 2 -0.417,0.5; 4 -0.417,-0.5; 5 -0.417,-1; 6 0.417,-1; 7 0.417,-0.5; 9 0.417,0.5; 10 0.417,1 | smd 0.565 x 0.4: 3 -0.417,0; 8 0.417,0
S-PVQFN-N16 = smd 0.85 x 0.28: 1 -0.725,2.225; 4 -0.725,0.725; 9 2.225,0.725; 12 2.225,2.225 | smd 0.85 x 0.78: 2 -0.725,1.475; 10 2.225,1.475 | smd 0.28 x 0.85: 5 0,0; 6 0.5,0; 7 1,0; 8 1.5,0; 13 1.5,2.95; 14 1,2.95; 15 0.5,2.95; 16 0,2.95 | smd 1.5 x 1.5: TH 0.75,1.475
SC-75_ONS-L = smd 0.305 x 0.61: 1 -0.5,-0.699; 2 0.5,-0.699; 3 0,0.699
QFN28_5X5_SIL-L = smd 0.864 x 0.203: 1 -2.273,1.5; 2 -2.273,1; 3 -2.273,0.5; 4 -2.273,0; 5 -2.273,-0.5; 6 -2.273,-1; 7 -2.273,-1.5; 15 2.273,-1.5; 16 2.273,-1; 17 2.273,-0.5; 18 2.273,0; 19 2.273,0.5; 20 2.273,1; 21 2.273,1.5 | smd 0.203 x 0.864: 8 -1.5,-2.273; 9 -1,-2.273; 10 -0.5,-2.273; 11 0,-2.273; 12 0.5,-2.273; 13 1,-2.273; 14 1.5,-2.273; 22 1.5,2.273; 23 1,2.273; 24 0.5,2.273; 25 0,2.273; 26 -0.5,2.273; 27 -1,2.273; 28 -1.5,2.273 | smd 3.353 x 3.353: 29 0,0
B3QFN15_RDA_TEX = smd 1.6 x 0.508: 1 -2.057,2.025; 7 -2.057,-2.025; 8 2.057,-2.025; 14 2.057,2.025 | smd 0.914 x 0.406: 2 -2.4,1.3; 3 -2.4,0.65; 4 -2.4,0; 5 -2.4,-0.65; 6 -2.4,-1.3; 9 2.4,-1.3; 10 2.4,-0.65; 11 2.4,0; 12 2.4,0.65; 13 2.4,1.3 | smd 2.54 x 2.54: 15 0,0
XCVR_ESP32-WROOM-32U = smd 2 x 0.9: 1 -8.5,8.41; 2 -8.5,7.14; 3 -8.5,5.87; 4 -8.5,4.6; 5 -8.5,3.33; 6 -8.5,2.06; 7 -8.5,0.79; 8 -8.5,-0.48; 9 -8.5,-1.75; 10 -8.5,-3.02; 11 -8.5,-4.29; 12 -8.5,-5.56; 13 -8.5,-6.83; 14 -8.5,-8.1; 25 8.5,-8.1; 26 8.5,-6.83; 27 8.5,-5.56; 28 8.5,-4.29; 29 8.5,-3.02; 30 8.5,-1.75; 31 8.5,-0.48; 32 8.5,0.79; 33 8.5,2.06; 34 8.5,3.33; 35 8.5,4.6; 36 8.5,5.87; 37 8.5,7.14; 38 8.5,8.41 | smd 0.9 x 2: 15 -5.715,-9.1; 16 -4.445,-9.1; 17 -3.175,-9.1; 18 -1.905,-9.1; 19 -0.635,-9.1; 20 0.635,-9.1; 21 1.905,-9.1; 22 3.175,-9.1; 23 4.445,-9.1; 24 5.715,-9.1 | smd 1.33 x 1.33: G.1 0.835,2.745; G.2 -1,2.745; G.4 -2.835,2.745; G.5 0.835,0.91; G.6 -1,0.91; G.7 -2.835,0.91; G.8 0.835,-0.925; G.9 -1,-0.925; G.10 -2.835,-0.925 | drill 0.254: G.11 -0.083,2.745; G.12 -1.917,2.745; G.13 0.835,1.827; G.14 -1,1.827; G.15 -2.835,1.827; G.16 -0.083,0.91; G.17 -1.917,0.91; G.18 0.835,-0.007; G.19 -1,-0.007; G.20 -2.835,-0.007; G.21 -0.083,-0.925; G.22 -1.917,-0.925
1296-10 = smd 0.76 x 2.05: 1 -2.54,-1.78; 2 -2.54,1.78; 3 -1.27,-1.78; 4 -1.27,1.78; 5 0,-1.78; 6 0,1.78; 7 1.27,-1.78; 8 1.27,1.78; 9 2.54,-1.78; 10 2.54,1.78
SMA90_DIP = drill 1.5 pad 2.54: ANTENNA 0,0 | drill 1.6 pad 2.54: GND1 -2.54,2.54; GND2 2.54,2.54; GND3 -2.54,-2.54; GND4 2.54,-2.54

### Placement (x,y rotation side)
C6  18.4,62.9 180 top
C7  28.95,62.7 180 top
C8  29.4,65.3 0 top
C10  28.1,64.7 270 top
C11  26.4,61.8 90 top
C12  18.9,67.3 270 top
C13  29,60.5 90 top
C15  26.5,64.8 270 top
C16  16.05,62.35 90 top
C17  27.3,64.75 270 top
C18  18.85,61.5 90 top
C19  27.5,62.95 90 top
C20  14.2,62.35 90 top
C21  12.9,63.7 180 top
C22  19.65,62.15 90 top
C23  19.7,66.55 270 top
C24  24.85,60.4 90 top
C26  3.1,13.45 0 top
C27  5.95,13.45 180 top
C28  9.45,8.1 90 top
C29  60.95,32.8 180 top
C30  16.2,19.8 90 top
C31  14.4,19.75 90 top
C32  65.1,29.6 0 top
C35  3.05,3.85 0 top
C36  5.9,3.85 180 top
C37  3.05,5.25 0 top
C39  5.9,5.25 180 top
D1  1.8,42.3 180 top
D2  1.8,44.4 180 top
D5  1.8,40.15 180 top
D6  1.8,38.15 180 top
E1  39.55,38.6 0 top
E2  43.1,38.6 0 top
F2  11.75,19.25 0 top
J1  2.75,21.5 270 top
L2  26.8,60.2 0 top
L4  19.15,65.15 315 top
L5  18.65,63.7 0 top
L6  16.8,63.7 0 top
L7  14.95,63.7 0 top
Q2  28.5,66.9 45 top
Q3  21.3,69.35 0 top
R1  3.8,44.4 180 top
R2  29.9,64 90 top
R4  3.8,42.3 180 top
R8  13.2,17 0 top
R9  16.4,33.25 180 top
R10  15.3,19.8 270 top
R11  13.25,15.7 0 top
R12  15.5,13.7 90 top
R13  19.65,18.4 0 top
R14  8.2,7.2 270 top
R15  62.75,32.8 0 top
R16  8.2,9 90 top
R17  19.95,17 0 top
R18  15.7,21.2 0 top
R19  17.45,21.2 0 top
R20  16.4,32.4 0 top
R21  17.35,22.1 180 top
R22  3.8,40.15 180 top
R23  3.8,38.15 180 top
RESET  61.05,30.95 0 top
SV1  38.55,3 0 top
U1  23.1,64.3 270 top
U4  33.3,66.9 90 top
U5  17.75,16 90 top
U7  15.15,30.85 0 top
U9  17.75,25.6 0 top
U11  17.95,30.8 0 top
U12  10.3,22.75 0 top
U14  33.3,57.9 90 top
U25  4.45,9.35 0 top
U28  57.25,19.1 270 top
X1  33.3,62.4 270 top
X2  4.2,63.75 90 top

### Tracks (layer width: path | path; a pad name or v marks a point on that pad's centre or on a via)
BOOT  (via drill 0.2)
  Top 0.152: U7.3 v15.15,32.5 | v47.7,10.4 48.95,10.4 U28.25
  Bottom 0.152: v15.15,32.5 17.18,32.5 17.69,31.99 20.11,31.99 42.15,9.95 47.25,9.95 v47.7,10.4
CHG  (via drill 0.2)
  Top 0.127: U5.9 17.73,18.22 v17.85,18.35 17.9,18.4 R13.1
  Top 0.15: v29.45,20.75 v30.85,22.15 | v38.15,25.5 39.2,25.5 44.6,30.9 53.94,30.9 56.75,28.08 56.75,27.62 U28.8
  Bottom 0.15: v17.85,18.35 18.75,19.25 27.95,19.25 v29.45,20.75 | v30.85,22.15 33,24.3 34.95,24.3 36.15,25.5 v38.15,25.5
CS
  Top 0.15: SV1.3 27.12,4.42 37.36,14.65 U28.23
D+  (via drill 0.2)
  Top 0.127: J1.A6 8.7,21.75 9.2,22.25 U12.4 U12.7 11.15,22.25 v11.73,22.82 14.5,25.6 U9.4 | J1.B6 9.1,20.75 v9.3,20.95
  Bottom 0.127: v9.3,20.95 11.17,22.82 v11.73,22.82
D-
  Top 0.127: U9.5 14.7,25.1 11.35,21.75 U12.6 U12.5 9.25,21.75 8.75,21.25 J1.A7 6.95,21.25 6.75,21.45 6.75,22.1 6.9,22.25 J1.B7
DC
  Top 0.15: SV1.5 42.59,13.38 U28.24
DECOUPLE
  Top 0.203: C24.2 24.9,60.92 U1.30
DTR
  Top 0.127: R20.1 15.65,32.07 U7.2 15.65,29.5 16.25,28.9 U9.28
GND  (via drill 0.2, 0.25, 0.3)
  Top 0.15: 21,65.3 21.05,65.35 21.65,65.35 22.7,64.3 U1.41 23.05,64.3 v21.7,65.65 | U1.13 20.8,65.3 | 24.15,63.35 25.55,63.35 U1.33 | C37.2 3.8,7.19 v4.02,7.41 | U9.3 15.53,26.15 17.2,26.15 U9.29 | C26.2 4.02,13.28 v4.02,11.31
  Top 0.2: 20.8,65.3 21,65.3 21.45,65.3 21.5,65.35
  Top 0.305: C23.1 19.7,68.29 v19.65,68.34
  Top 0.368: 19,61.02 C18.1 18.9,60.97 v18.9,60.2 | 18.95,67.77 C12.1 18.9,68.65 v18.85,68.65 | 19.72,61.61 C22.1 19.65,60.76 v19.9,60.51
  other vias: 16.45,64.7 17.5,64.7 18.6,64.55 26.65,63.1 18.15,66.55 16.1,61 14.2,60.9 15.3,64.7 14.15,64.7 11.2,68.6 25.75,73.55 4.19,58.7 15.44,68.62 25.76,71.54 22.6,73.9 24.6,71.45 19.4,72.5 17,67.65 13.35,67.55 14.8,67.6 18.1,62.05 34.15,80.4 30.8,80.8 30.7,78.65 33.3,78.1 32.6,72.8 32,75.55 30,75.8 28,78.55 12.75,78.75 25.35,79.8 23.45,80.7 9.05,70.65 23.15,77.4 27.6,74.9 29.8,71.6 14,66.55 15.45,66.55 16.85,66.55 24.4,47.55 18.8,71.15 21.75,71.2 20.4,73.85 18.9,75.2 15.15,61.75 15.15,62.8 11.4,74.7 19.2,79.75 19.7,9.45 12.4,65.4 12.25,62.75 13.3,61.65 10.9,62.85 13.3,62.75 10.9,61.55 12.25,60.8 10.85,59.55 11,56.25 17,61.7 33.55,71.15 17,62.8 13.5,53.55 11.8,51.8 14.5,49.55 11.6,48.6 17.35,48.35 11.95,45 7.1,41.25 13.65,43.05 11.65,40.95 3.05,37.1 14.1,37.1 21.85,46.75 31.5,47.75 16.6,35.45 21.95,36.05 25.85,32.2 27,8.4 24.55,13.9 22.6,14.55 27.85,54.5 21,12.05 19.75,15.2 17.65,6.95 21.65,5.35 16.7,12.55 29.65,58.55 11.85,13.65 9.25,11.95 10.25,16.4 25.75,59.15 26.95,58.85 11.7,7.8 9.2,14.95 20.05,50.45 20.7,77.1 18.73,37.28 24.52,6.81 26.9,30.18 24.78,30.18 27.32,5.91 9.37,67.32 9.07,64.65 9.07,62.82 9.37,60.95 9.37,58.83 10.77,64.61 9.37,54.59 9.37,52.47 9.37,50.35 5.17,50.83 9.37,46.1 9.37,43.98 9.37,41.86 12.37,34.8 13.87,33.3 42.3,34.08 32.85,34.13 26.17,16.55 29.17,13.55 27.67,15.05 30.7,57.5 32.07,54.15 15.3,9 12.4,66.7 16.95,58 9.75,10.2 11.95,10.05 17.4,69.1 18.55,57.65 19.55,69.9 15.55,59.25 13.55,59.25 14.85,57.55 13.75,56.4 17.2,60.05 16,55.7 22.7,56.25 21.2,54.8 20.4,57.85 23.55,65.65 23.55,64.75 23.55,63.85 23.55,62.95 22.6,62.95 22.6,63.85 22.6,64.75 22.6,65.65 21.7,64.75 21.7,63.85 21.7,62.95 24.5,63.85 24.5,62.95 24.5,64.75 24.5,65.65 33.27,61.4 33.27,62.3 29.97,61.9 30.02,60.35 29.37,66.2 27.22,65.95 21.02,60.85 20.52,59.3 18.52,58.95 0.57,16.95 0.57,14.83 0.57,12.71 0.57,10.59 0.57,8.47 14.33,0.57 16.45,0.57 18.57,0.57 20.7,0.57 22.82,0.57 24.94,0.57 27.15,0.57 29.27,0.57 31.39,0.57 33.51,0.57 35.63,0.57 37.75,0.57 39.87,0.57 42,0.57 44.12,0.57 46.24,0.57 0.57,59.25 0.57,57.13 0.57,55.01 0.57,52.89 0.57,50.77 0.57,48.65 0.57,46.53 3.02,45.5 3.02,43.33 3.02,41.21 3.07,39.15 0.57,36.03 0.57,33.91 0.57,31.79 0.57,29.67 0.57,27.55 0.57,25.43 0.57,23.3 0.57,21.18 0.57,19.06 48.25,0.57 50.37,0.57 52.49,0.57 54.61,0.57 56.73,0.57 58.85,0.57 60.97,0.57 63.1,0.57 65.22,0.57 66.43,1.55 66.43,3.67 66.43,5.79 66.43,7.91 66.43,12.15 66.43,14.27 66.43,16.4 66.43,18.52 66.43,20.64 66.43,22.65 66.43,24.77 66.43,29.01 66.43,31.13 66.43,33.25 66.43,35.37 66.28,37.5 37.35,39.47 41.59,39.47 45.83,39.47 47.95,39.47 50.07,39.47 52.2,39.47 54.32,39.47 56.44,39.47 36.47,47.43 36.47,45.3 36.47,43.18 36.47,41.06 36.47,51.48 36.47,49.36 36.47,89.55 36.47,87.43 36.47,85.31 36.47,83.19 36.47,81.07 36.47,78.95 36.47,76.83 36.47,74.7 36.47,72.58 36.47,70.46 22.55,90.47 24.67,90.47 26.79,90.47 28.91,90.47 31.03,90.47 33.15,90.47 35.27,90.47 1.45,90.47 3.57,90.47 5.69,90.47 7.81,90.47 9.93,90.47 12.05,90.47 14.17,90.47 16.3,90.47 18.42,90.47 20.54,90.47 0.53,68.05 0.53,70.17 0.53,72.29 0.53,74.41 0.53,76.53 0.53,78.65 0.53,80.77 0.53,82.9 0.53,85.02 0.53,87.14 0.53,89.15 29.55,35.95 37.4,24.4 26.95,34.4 23.6,35.2 21.9,33.45 20.05,30.55 29.35,29 22.05,26.65 27,28.1 23.75,24.7 23.75,19.85 26.05,21.7 29.15,24.85 31.6,27.5 29.4,11.1 24.45,10.05 32.05,17.7 36.35,17.1 37.95,36.15 35.05,25.3 33.3,22.45 35.75,32.4 33.05,29.95 30.15,32.1 28.83,18.93 34.76,19.58 33.71,16.28 33.02,14 23.97,14.95 36.95,28.8 44.4,36.5 41.95,29.05 31.3,36.45 14.95,45.7 26.5,53.55 16.5,43.1 15.7,39.75 5.45,34.15 19.7,40.75 20.9,43.6 7.9,36.75 22.85,40.55 26.2,39.9 31.05,39.9 29.2,42.2 27.9,45.6 24.65,45.6 56.9,37.15 25.4,43.35 53,37.25 54.85,30.9 14.75,54.1 24.45,51.05 28.45,49.45 18.5,51.9 20.95,49.2 18.8,46.3 31.97,44.98 31.32,50.91 34.62,49.86 48.35,37.37 35.95,40.12 22.1,53.1 16.2,52.35 18.75,54.15 14.45,47.45 18.4,88.15 19.95,85.55 19.15,82.2 6.5,78.95 23.15,83.2 24.35,86.05 27.7,80.65 26.3,83 29.65,82.35 34.5,82.35 32.65,84.65 31.35,88.05 28.1,88.05 22.25,88.75 35.42,87.43 9.45,89.75 17.3,78.2 6.85,88.2 3.5,89 1.8,87.25 4.5,85 7.35,83.8 1.95,80.45 4.3,81.85 3.65,78.5 3.65,73.65 5.95,75.5 9.35,76.8 9.35,80.05 6.6,70.9 7.3,68.65 11.95,71.5 16.25,70.9 17.85,89.95 14.8,80.25 13.2,76.25 15.85,85.15 12.95,83.75 10.05,85.9 8.73,72.73 14.66,73.38 13.61,70.08 2.37,70.25 3.87,68.75 16.85,82.6 16.1,88.5 17.9,85.95 3.45,32.85 2.65,29.5 4.4,27.8 6.65,30.5 7.85,33.35 11.2,27.95 9.8,30.3 2.5,56.6 2.5,51.75 6.4,52.3 7.4,48.45 4.6,48 5.8,57.6 3.6,53.85 7.58,50.83 2.77,49.7 2.72,46.85 4.05,56.15 7.1,55.35 18.18,3.57 12.48,1.77 11.53,4.47 4.87,11.31 4.02,10.51 4.87,10.51 4.02,9.76 4.87,9.76 4.02,8.96 4.87,8.96 4.02,8.21 4.87,8.21 4.87,7.41 26.1,67.15 58.45,39.47 60.57,39.47 62.69,39.47 64.81,38.87 18.2,26 18.2,25.1 17.25,25.1 17.25,26
  pour Top: 3.4,3.4 3.4,5.85 3.5,5.95 3.7,6.15 3.7,8.05 5.15,8.05 5.2,8 5.2,6.15 5.5,5.85 5.55,5.8 5.55,5.6 5.55,3.45 5.55,3.4
  pour Top: 1.65,10.15 7.5,10.15 7.9,10.55 7.9,15.35 6.75,16.5 6.75,18.15 7.1,18.5 8.5,18.5 9.75,17.25 13.1,17.25 13.1,8.7 11.9,7.5 10.7,7.5 10.2,8 8.5,8 7.95,8.55 6.15,8.55 5.65,8.05 1.65,8.05
  pour Top: 3.7,11.4 3.7,12.6 3.45,12.85 3.45,13.95 3.55,14.05 5.5,14.05 5.65,13.9 5.65,12.95 5.2,12.5 5.2,11.45 5.15,11.4
  pour Top: 1.65,8.05 0.25,8.05 0.05,8.25 0.05,26.6 7.95,26.6 8.6,25.95 8.6,19.8 8.4,19.6 7,19.6 6.8,19.4 6.8,18.55 7.15,18.2 7.15,16.75 6.85,16.45 2.2,16.45 1.2,15.45 1.2,10.35 1.4,10.15 1.7,10.15 1.7,8.1
  pour Top: -0.2,26.55 -0.2,89.8 0.9,90.9 36.4,90.9 37.05,90.25 37.05,41 37.35,40.7 63.9,40.7 67.05,37.55 67.05,0.9 66.1,-0.05 13.05,-0.05 10.75,2.25 10.75,12.1 16.05,17.4 17.2,17.4 18,18.2 18,19.5 17.35,20.15 15.95,20.15 15.65,19.85 14.25,19.85 14.15,19.95 14.15,20.55 13.3,21.4 10.35,21.4 5.2,26.55
  pour Bottom: -0.2,89.8 0.85,90.85 36.55,90.85 37,90.4 37,41.15 38.05,40.1 64.9,40.1 67.5,37.5 67.5,1.1 66.15,-0.25 1.1,-0.25 -0.2,1.05
  pour Route2: -0.1,89.85 1.25,91.2 36.15,91.2 37,90.35 37,41.1 38,40.1 64.85,40.1 67.5,37.45 67.5,1.05 66.15,-0.3 1.1,-0.3 -0.1,0.9
IO1  (via drill 0.2)
  Top 0.152: U28.31 56.77,11.98 v56.65,12.1 | v25.05,69.01 24.51,69.01 23.3,67.8 U1.5
  Bottom 0.152: v56.65,12.1 56.65,14.35 51,20 51,25.77 44.14,32.63 38.47,32.63 32.55,38.55 32.55,52.64 35.76,55.86 35.76,67.7 34.38,69.09 33.04,69.09 32.74,68.78 25.28,68.78 v25.05,69.01
IO2  (via drill 0.2)
  Top 0.152: U28.33 59.31,12.04 v59.2,12.15 | U1.6 22.9,67.8 24.62,69.52 25.26,69.52 25.49,69.29 v25.78,69.29
  Bottom 0.152: v59.2,12.15 56.93,14.42 56.93,14.47 51.28,20.12 51.28,25.88 44.25,32.91 38.59,32.91 32.83,38.67 32.83,52.53 36.04,55.74 36.04,67.81 34.49,69.36 32.92,69.36 32.62,69.06 26.01,69.06 v25.78,69.29
IO3  (via drill 0.2)
  Top 0.152: U28.36 63.12,12.08 v63,12.2 | U1.7 22.5,67.79 24.51,69.8 25.99,69.8 26.22,69.57 v26.52,69.57
  Bottom 0.152: v63,12.2 61.1,14.1 57.8,14.1 51.56,20.34 51.56,26 44.37,33.19 38.7,33.19 33.11,38.78 33.11,52.41 36.34,55.65 36.34,67.91 34.61,69.64 32.81,69.64 32.51,69.34 26.74,69.34 v26.52,69.57
IO4  (via drill 0.2)
  Top 0.152: U28.10 54.25,27.58 v54.25,25.75 | U1.8 22.1,67.78 24.39,70.08 26.73,70.08 26.95,69.85 v27.25,69.85
  Bottom 0.152: v54.25,25.75 52.2,25.75 44.48,33.47 38.94,33.47 33.39,39.02 33.39,52.3 36.62,55.53 36.62,68.02 34.72,69.92 32.69,69.92 32.39,69.62 27.48,69.62 v27.25,69.85
LCDRST  (via drill 0.2)
  Top 0.15: U28.26 50.42,9.18 v50.45,9.15 | SV1.4 29.66,4.31 v30.35,5
  Bottom 0.15: v30.35,5 30.5,5 34.61,9.11 50.41,9.11 v50.45,9.15
LED  (via drill 0.2)
  Top 0.15: v54.05,8.6 54.23,8.78 U28.29
  Bottom 0.15: SV1.8 39.82,4.15 43.92,8.25 53.7,8.25 v54.05,8.6
LED1  (via drill 0.2)
  Top 0.152: U1.25 22.9,61.32 22.69,61.11 22.69,60.69 22.85,60.53 v22.85,60.1 | v5.1,44.4 R1.1
  Bottom 0.152: v22.85,60.1 22.85,59.58 20.07,56.8 18.65,56.8 6.25,44.4 v5.1,44.4
LED2  (via drill 0.2)
  Top 0.152: R4.1 v5.15,42.3 | v23.2,60.9 23.2,61.15 23.3,61.25 U1.26
  Bottom 0.152: v5.15,42.3 6.4,43.55 6.4,44.15 18.77,56.52 20.18,56.52 23.36,59.69 23.36,60.74 v23.2,60.9
N$1
  Top 0.15: D2.1 R1.2
N$5
  Top 0.203: C21.2 arc90 12.45,63.72 12.45,64.25 12.5,64.3
  Top 0.368: L4.1 18.58,65.72 13.92,65.72 12.5,64.3 | 12.45,64.25 12.42,64.22 C21.2 4.25,63.7 X2.ANTENNA
N$6
  Top 0.2: U1.17 20.35,63.7
  Top 0.203: U1.17 20.09,63.7
  Top 0.368: C6.1 18.88,62.91 L5.2 20.09,63.7
N$7
  Top 0.15: D1.1 R4.2
N$11
  Top 0.127: U5.14 R8.2
N$12
  Top 0.127: U5.12 15.53,19.15 R10.2
N$13
  Top 0.127: R11.2 13.98,16 U5.16
N$14
  Top 0.152: U9.8 16.25,22.55 16.12,22.42 R18.2 R19.1
N$15
  Top 0.152: R21.2 16.75,22.27 U9.9
N$16
  Top 0.127: Q3.3 21.78,69.88 21.3,69.39 21.3,67.7 21.7,67.3 U1.9
N$17
  Top 0.127: U1.10 21.3,67.3 20.62,67.97 Q3.1
N$18
  Top 0.127: Q2.1 27.86,66.55 27.06,66.55 26.22,65.72 25.61,65.72 U1.39
N$19
  Top 0.127: Q2.2 27.39,67.39 26.1,66.1 U1.40
N$20
  Top 0.2: 20.2,64.5 U1.15
  Top 0.203: U1.15 20.09,64.5
  Top 0.368: L4.2 19.8,64.5 20.09,64.5
N$21
  Top 0.15: R22.2 D5.1
N$22
  Top 0.2: 17.1,63.7 L6.2
  Top 0.368: 17.1,63.7 L5.1 C6.2
N$23
  Top 0.2: L6.1 16.05,63.7 | 16.05,63.7 L7.2 | 16.05,63.4 16.05,63.7
  Top 0.368: C16.2 16.05,63.4 16.05,63.68 L6.1 L7.2
N$24
  Top 0.368: C21.1 L7.1 14.22,62.84 C20.2
N$25
  Top 0.15: D6.1 R23.2
N$26  (via drill 0.2)
  Top 0.152: U28.12 51.67,27.62 51.67,28.58 51.06,29.2 46.05,29.2 v46,29.25 | v5.05,38.2 4.28,38.2 R23.1
  Bottom 0.152: v5.05,38.2 32.11,38.2 38.23,32.07 43.73,32.07 45.45,30.35 45.45,29.88 46,29.33 v46,29.25
N$27  (via drill 0.2)
  Top 0.152: R22.1 v5,40.15 | v45.96,30.09 51.51,30.09 52.96,28.64 U28.11
  Bottom 0.152: v5,40.15 6.67,38.48 32.22,38.48 38.35,32.35 43.9,32.35 45.96,30.29 v45.96,30.09
N$29
  Top 0.127: U11.1 17.45,32.25 17.3,32.4 R20.2
N$30
  Top 0.127: U7.1 14.65,32.7 15.2,33.25 R9.2
N$91
  Top 0.127: U25.9 7.78,8.05 R14.1 R16.1
PGOOD  (via drill 0.2)
  Top 0.127: U5.7 v18.65,17 R17.1
  Top 0.15: v29.43,20.02 31.02,21.61 v31.34,21.61 | U28.9 55.43,27.67 55.43,28.13 52.97,30.6 44.85,30.6 39.24,24.99 v36.92,24.99
  Bottom 0.15: v18.65,17 19.55,17.9 21.3,17.9 22.37,18.97 28.13,18.97 28.61,19.46 28.87,19.46 v29.43,20.02 | v31.34,21.61 33.76,24.02 35.06,24.02 36.09,25.05 36.87,25.05 v36.92,24.99
PTI_DATA  (via drill 0.2)
  Top 0.127: X1.10 34.99,59.95 34.45,59.95 34.3,59.8 U14.6 U14.5 34.3,56.79 v34.39,56.69
  Top 0.152: U1.4 23.7,67.48 v24.08,67.87
  Bottom 0.152: v24.08,67.87 24.42,68.2 30.05,68.2 31.2,67.05 31.2,58.4 32.72,56.88 33.64,56.88 33.82,56.69 v34.39,56.69
PTI_FRAME  (via drill 0.2)
  Top 0.127: X1.9 32.24,59.86 32.3,59.8 U14.10 U14.1 31.88,57.48 v31.5,57.1
  Top 0.152: v24.78,67.59 24.55,67.37 24.31,67.37 24.1,67.16 U1.3
  Bottom 0.152: v31.5,57.1 31.5,57.7 30.8,58.4 30.8,67.05 29.93,67.92 25.1,67.92 v24.78,67.59
RESET  (via drill 0.2)
  Top 0.127: X1.3 32.27,63.67 32.73,64.14 32.73,65.52 32.3,65.95 U4.1 U4.10 31.8,67.82 v31.8,68.2 | U1.11 20.61,66.69 v20.4,66.9
  Top 0.305: X1.3 30,63.67 R2.1
  Bottom 0.127: v20.4,66.9 20.4,67.35 20.19,67.56 20.19,70.19 20.4,70.4 22.5,70.4 24.38,68.52 30.16,68.52 30.48,68.2 v31.8,68.2
RST  (via drill 0.2)
  Top 0.152: U11.3 17.95,32.45 v17.9,32.5 | v50.49,24.8 62.25,24.8 63.15,25.7 63.15,27.57 U28.3
  Top 0.2: U28.3 63.12,30.75 62.94,30.94 RESET.2 62.5,31.38 62.5,32.62 R15.1 C29.1
  Bottom 0.152: v17.9,32.5 20,32.5 26.35,26.15 49.73,26.15 49.74,26.16 50.16,26.16 50.7,25.62 50.7,24.95 50.55,24.8 v50.49,24.8
RTS
  Top 0.127: R9.1 17.85,33.25 18.45,32.65 U11.2 18.45,29.05 18.25,28.85 U9.24
RX  (via drill 0.2)
  Top 0.127: X1.4 34.91,63.5 34.45,63.5 33.87,64.08 33.87,65.4 34.3,65.83 U4.5 U4.6 34.45,67.32 34.95,66.82 v34.95,66.15 | v34.95,66.15
  Top 0.152: U1.28 24.1,59.7 24.5,59.3 24.7,59.3 25.99,58.01 25.99,57.27 25.85,57.14 v25.85,56.6
  Bottom 0.152: v25.85,56.6 25.87,56.58 28.47,56.58 29.62,55.43 31.77,55.43 32.15,55.04 34.16,55.04 35.2,56.09 35.2,65.9 v34.95,66.15
RXD  (via drill 0.2)
  Top 0.127: U9.26 17.25,28.7 v16.9,29.05
  Top 0.152: U28.34 60.58,12.22 v60.55,12.25
  Bottom 0.152: v16.9,29.05 17.19,29.34 17.19,29.58 17.49,29.87 17.91,29.87 18.08,29.7 22.01,29.7 42.03,9.67 49.49,9.67 49.81,9.99 58.29,9.99 v60.55,12.25
SCK  (via drill 0.2)
  Top 0.15: U28.30 55.5,8.9 54.34,7.74 v53.75,7.74 53.47,8.03 v53.47,9.05
  Bottom 0.15: SV1.7 37.28,3.38 42.55,8.65 53.06,8.65 v53.47,9.05
SDI  (via drill 0.2)
  Top 0.15: SV1.6 34.74,3.85 36.22,5.33 v41.72,5.33 | v64.1,8.95 64.39,9.24 U28.37
  Bottom 0.15: v41.72,5.33 43.62,7.24 55.09,7.24 56.8,8.95 v64.1,8.95
SWCLK  (via drill 0.2)
  Top 0.127: X1.8 35.06,61.15 34,61.15 33.8,60.95 U14.7 U14.4 33.8,55.7 v33.95,55.55
  Top 0.152: U1.22 21.7,58.85 23.46,57.09 v24.66,57.09
  Bottom 0.152: v33.95,55.55 33.84,55.44 32.15,55.44 31.88,55.71 29.84,55.71 28.44,57.11 25.64,57.11 25.63,57.09 v24.66,57.09
SWDIO  (via drill 0.2)
  Top 0.127: X1.7 32.57,61.13 32.8,60.9 U14.9 U14.2 32.8,56.1 v32.7,56
  Top 0.152: v25.2,57.6 23.35,57.6 22.06,58.89 22.06,61.77 U1.23
  Bottom 0.152: v32.7,56 32.69,55.99 30.11,55.99 28.55,57.55 25.25,57.55 v25.2,57.6
SWO  (via drill 0.2)
  Top 0.127: X1.6 34.4,62.4 33.61,63.19 33.61,65.5 33.8,65.69 U4.4 U4.7 33.8,68.05 v34.05,68.3
  Top 0.152: v24.65,58.13 24.56,58.04 23.34,58.04 22.34,59.04 22.34,61.16 22.5,61.31 U1.24
  Bottom 0.152: v24.65,58.13 28.42,58.13 30.25,56.3 31.85,56.3 32.15,56.6 33.3,56.6 33.71,56.19 34.6,56.19 34.92,56.51 34.92,65.4 34.03,66.3 34.03,68.28 v34.05,68.3
T_CLK  (via drill 0.2)
  Top 0.15: SV1.10 44.95,3.05 44.95,10.55 v44.9,10.6 | v49.95,25.65 50.42,26.12 U28.13
  Bottom 0.15: v44.9,10.6 44.85,10.65 44.85,24.65 45.85,25.65 v49.95,25.65
T_CS
  Top 0.127: 51.69,8.9 51.69,8.89 47.44,4.64 SV1.11
  Top 0.15: U28.27 51.69,8.9 47.44,4.65 SV1.11
T_DI  (via drill 0.2)
  Top 0.152: v46,6.65 46,7.59 45.48,8.11 45.48,11.13 v45.41,11.2 | v45.39,22.8 46.14,23.54 U28.16
  Bottom 0.152: SV1.12 49.98,4.77 48.65,6.1 46.55,6.1 v46,6.65 | v45.39,22.8 45.41,22.79 v45.41,11.2
T_DO  (via drill 0.2)
  Top 0.15: U28.14 48.51,27.6 v46.06,25.14 | v45.98,10.5 45.98,8 v47.25,6.73
  Bottom 0.15: v46.06,25.14 45.95,25.04 45.95,10.62 45.98,10.58 v45.98,10.5 | v47.25,6.73 47.35,6.63 48.89,6.63 SV1.13
T_IRQ
  Top 0.127: 52.96,10.35 U28.28
  Top 0.15: SV1.14 55.06,5.34 52.96,7.44 52.96,10.35
TS
  Top 0.127: R12.2 15.5,15.25 U5.1
TX  (via drill 0.2)
  Top 0.127: X1.5 32.2,62.4 32.99,63.19 32.99,65.62 32.8,65.81 U4.2 U4.9 32.8,67.95 v32.55,68.2
  Top 0.152: U1.27 23.69,61.79 23.69,61.13 23.71,61.11 23.71,60.69 23.69,60.67 23.69,59.67 24.56,58.8 24.72,58.8 25.71,57.81 25.71,57.39 25.41,57.09 25.39,57.09 25.34,57.04 25.34,56.05 v25.54,55.85
  Bottom 0.152: v25.54,55.85 28.7,55.85 29.4,55.15 31.65,55.15 32.04,54.76 34.28,54.76 35.48,55.97 35.48,67.58 34.26,68.81 33.16,68.81 v32.55,68.2
TXD  (via drill 0.2)
  Top 0.127: U9.25 17.7,27.92 v17.7,29.37
  Top 0.152: U28.35 61.85,12.1 v61.7,12.25
  Bottom 0.152: v61.7,12.25 61.7,12.2 59.16,9.66 50.12,9.66 49.85,9.39 41.92,9.39 21.94,29.37 v17.7,29.37
VBAT
  Top 0.7: U5.2 16.28,14.52 16.75,14.05 20.7,14.05 25.55,18.9 39.55,32.9 E1.PAD
VBUS
  Top 0.2: J1.A4B9 8.05,23.75 U12.1 U12.10
  Top 0.3: J1.A4B9 7.1,23.95 6.1,22.95 6.1,19.85 6.9,19.05 J1.B4A9
  pour Top: 7.15,18.8 7.15,19.3 8.55,19.3 8.75,19.5 9.65,20.4 9.65,20.5 10.25,20.5 10.25,18 9.65,18 9.45,18.2 8.85,18.8 8.65,18.8
VDCDC  (via drill 0.2, 0.35)
  Top 0.2: U1.34 27.23,63.7 C19.2 | 20.2,65.7 U1.12 | 18.94,66.79 C12.2 18.79,66.94
  Top 0.203: U1.18 20.2,63.3 19.65,62.75 C22.2
  Top 0.305: v18.17,61.15 18.32,61.3 18.32,61.39 18.85,61.92 C18.2 19.5,62.62 C22.2 | v18.2,67.6 18.37,67.43 18.37,67.35 18.79,66.94 | 18.94,66.79 19.65,66.08 C23.2 19.76,66.08 20.13,65.7 20.2,65.7 | C13.2 29.09,61.25
  Top 0.368: C7.2 28.48,62.96 28.98,63.47 v28.98,63.57
  Top 0.508: C13.2 28.48,61.77 C7.2 | C7.2 28.48,61.02 L2.2 | C7.2 27.75,63.42 C19.2
  Top 1.016: L2.2 28.7,61.25 C13.2
  Route15 0.368: v28.98,63.57 28.95,63.6 28.05,63.6 26.92,62.46 26.81,62.46 26.4,62.05 21.15,62.05 | v18.17,61.15 18.22,61.2 20.3,61.2 21.15,62.05 | 21.15,62.05 20.9,62.3 20.9,66.53 21.01,66.65 21.01,67.15 20.57,67.6 v18.2,67.6
VDD  (via drill 0.25, 0.3, 0.35)
  Top 0.15: v14.65,23.55 15.2,24.1 U9.7 U9.6 | R21.1 18.85,22.1 v18.9,22.05 | R17.2 21.25,17 v21.3,16.95 | R13.2 20.17,18.5 v21.15,18.5
  Top 0.2: U1.32 26.03,62.9 26.4,62.52 C11.2 | U1.36 26.33,64.5 C15.2 27.25,64.33 C17.2 28.05,64.27 C10.2 | U28.2 64.63,27.83 C32.1 v64.63,30.8 64.63,32.22 64.05,32.8 R15.2
  Top 0.203: U1.35 26.38,64.1 26.55,64.27 | R2.2 30.17,64.7 31.28,64.7 X1.1
  Top 0.305: C17.2 26.55,64.27 C15.2 | C10.2 28.73,64.22 v29,64.5 29.08,64.42 R2.2 | C11.2 26.91,61.77 v27.11,61.77
  Top 0.368: C10.2 27.35,64.22 27.25,64.33
  Top 0.508: 30.65,65.3 C8.2 30.5,65.92 | 30.65,65.3 31.42,65.3 31.52,65.2 | 30.83,66.02 30.65,65.85 30.65,65.3
  Top 0.61: 30.83,66.02 31.52,65.33 31.52,65.2 X1.1
  other vias: 1.45,2.75 1.05,3.6 1.05,4.6 1.05,5.6 1.05,6.6 6.75,2.65 5.55,2.65 4.55,2.65 3.55,2.65 2.55,2.65 8.05,2.65 8.05,3.65 8.05,4.65 8.05,5.65 9.1,3 9.1,4 9.1,5 9.1,6
  pour Top: 0.8,7.55 3.15,7.55 3.15,6.05 3,5.9 3,3.1 3.05,3.05 5.85,3.05 5.9,3.1 5.9,5.9 5.75,6.05 5.75,7.5 7.3,7.5 7.8,7 8.65,7 8.9,7.25 8.9,7.6 9,7.7 10.05,7.7 10.35,7.4 10.35,3.2 9.2,2.05 1.45,2.05 0.4,3.1 0.4,7.15
  pour Route15: 0.55,7.2 3.95,7.2 15.05,18.3 17.65,18.3 18.1,18.75 18.1,19.65 17.4,20.35 13.6,20.35 13.6,29 12.15,30.45 12.15,54.4 21.1,63.35 21.1,66.5 19.65,67.95 19.65,69.95 21.45,71.75 35.8,71.75 36.9,70.65 36.9,40.6 63.8,40.6 66.9,37.5 66.9,0.85 66,-0.05 1.2,-0.05 0.1,1.05 0.1,6.75
VIN  (via drill 0.25)
  Top 0.15: R19.2 17.88,20.42 v18.05,20.25
  Bottom 0.15: v18.05,20.25 16.35,20.25 v14.5,18.4
  pour Top: 13.25,19.55 14.6,19.55 14.6,19.05 14.95,18.7 15.15,18.5 15.15,17.4 14.2,17.4 14,17.6 13.6,18 13.3,18 13.25,18.05
VPROC  (via drill 0.2, 0.3)
  Top 0.178: U5.5 18.75,16 v18.85,15.9
  Bottom 0.178: v18.85,15.9 17.05,17.7 v17.05,19.4
  other vias: 6.95,14.9 6.25,15.55 5.65,14.95 4.95,15.5 4.2,15 3.5,15.55 2.9,14.9 2.05,14.6 2.3,15.5
  pour Top: 1.55,10.5 1.55,15.35 2.25,16.05 6.6,16.05 7.4,15.25 7.4,11.15 5.75,11.15 5.75,12.15 6,12.4 6,14.4 5.8,14.6 3.35,14.6 3.1,14.35 3.1,11.2 2.5,11.2 2.5,10.5
  pour Top: 15.95,17.85 15.95,19.4 16.35,19.8 17.25,19.8 17.5,19.55 17.5,19 17.4,18.9 16.8,18.9 16.6,18.7 16.6,17.85
  pour Route15: 1.55,14.05 1.55,15.4 2.2,16.05 10.1,16.05 13.85,19.8 17.2,19.8 17.45,19.55 17.45,19 17.4,18.95 14.65,18.95 9.75,14.05
VREGSW
  Top 0.2: 25.64,62.35 25.59,62.4
  Top 0.203: 25.59,62.4 U1.31
  Top 0.508: L2.1 25.64,60.5 25.64,62.35

### Text on the board
tStop: CPN | v2.0